# EAGLE schematic CarrerAI_BB_V1.0 (EAGLE 7.7.0)

## Sheet 1 of 2: POW-System Supply Chain
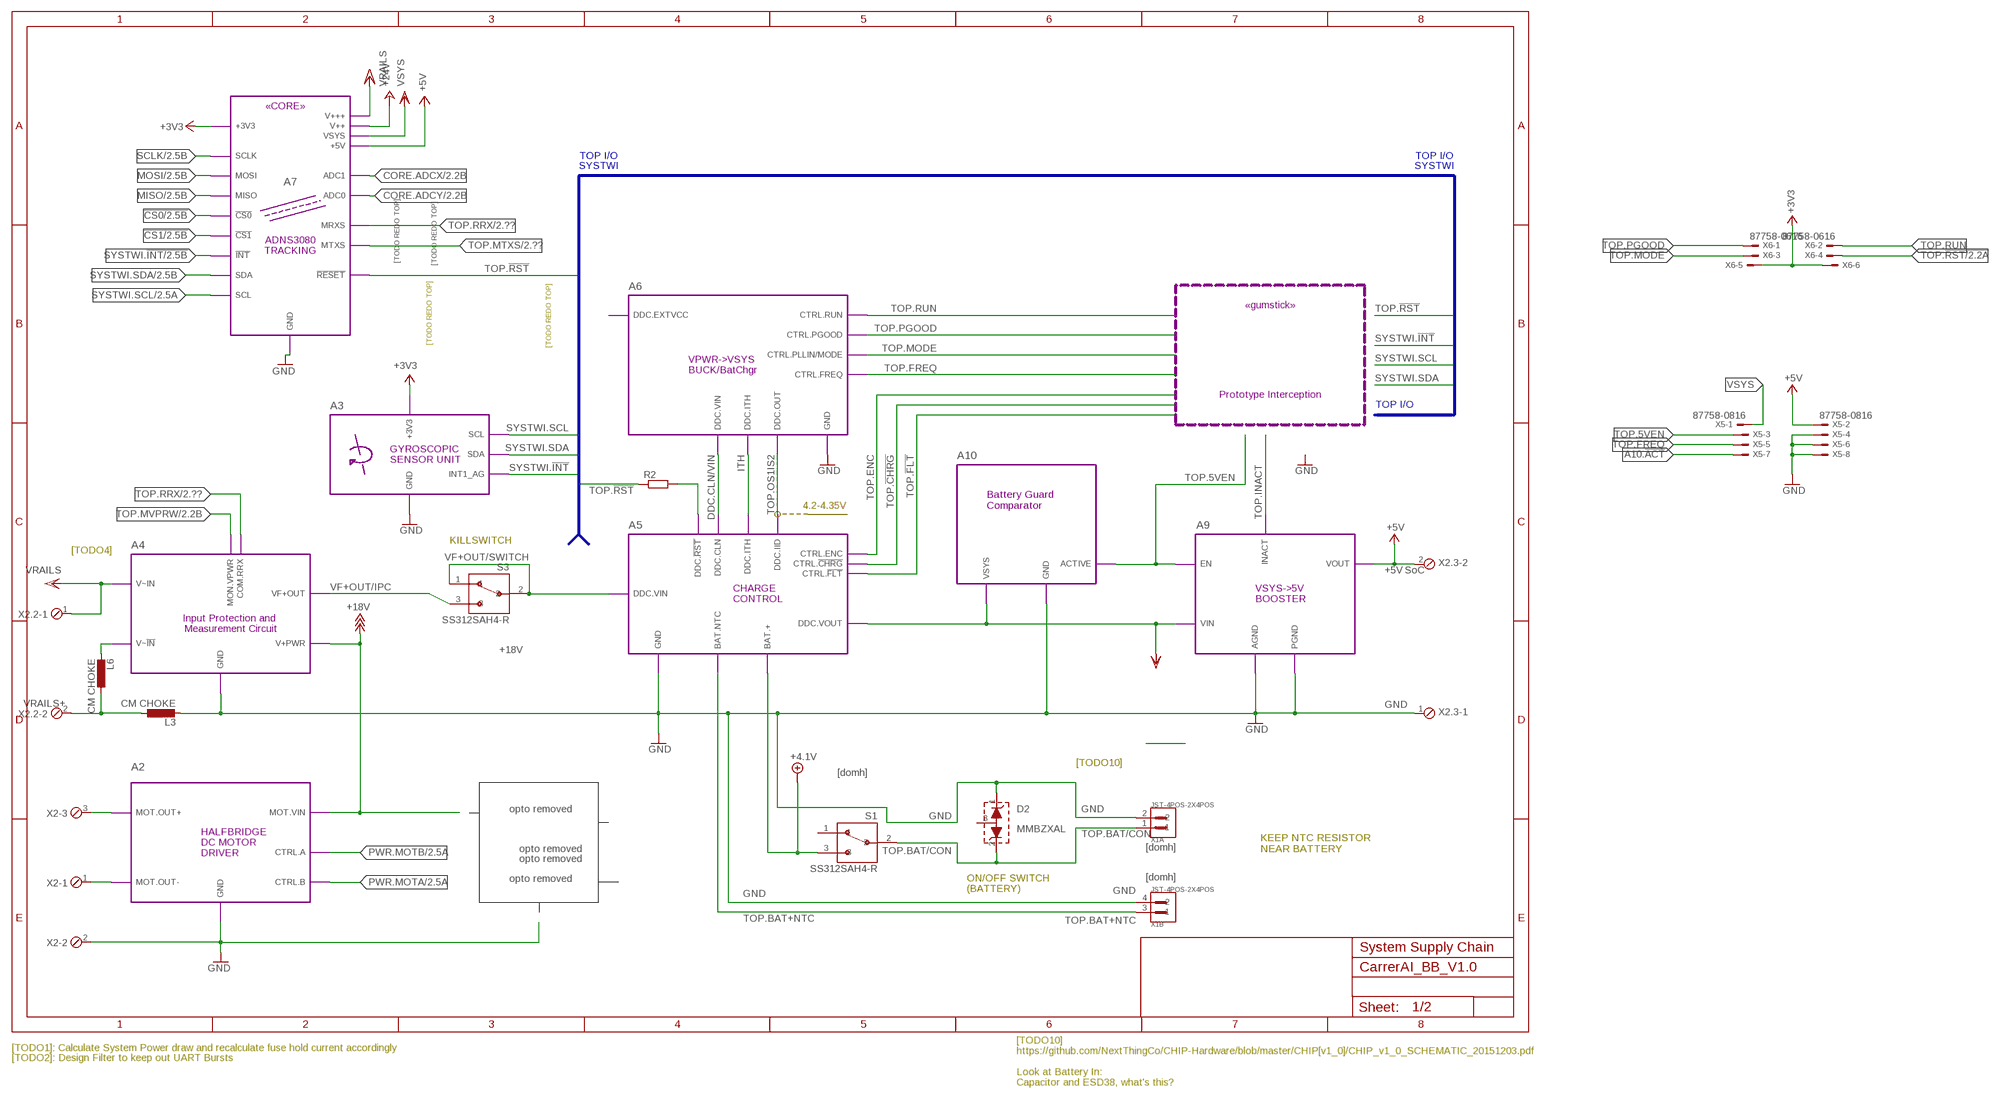
[diagram p0: schematic, sheet 1]

### Parts
D2  MMBZXAL  [TO236]
L3  CM CHOKE  L-EUL3216C  [L3216C]
L6  CM CHOKE  L-EUL3216C  [L3216C]
R2  R-EU_R0201  [R0201]
S1  SS312SAH4-R  [SW_SS312SAH4-R]
S3  SS312SAH4-R  [SW_SS312SAH4-R]
X1  JST-4POS-2X4POS  [JST-PHR-4]
X2  MPT3  [3POL254]
X2.2  VRAILS+  MPT2  [2POL254]
X2.3  SoC  MPT2  [2POL254]
X5  87758-0816  [87758-0816]
X6  87758-0616  [87758-0616]

### Module instances
A5 = POW-4000
A6 = POW-3891
A2 = POW-8871
A9 = POW-DDC3350
A7 = X1-TRACKBOARD3080
A4 = POW-IPMC
A3 = SEN-GYRO1
A10 = POW-1540

### Nets
!CS0: port A7.!CS0 ; also sheet 2
!CS1: port A7.!CS1 ; also sheet 2
!RST: R2.2 ; port A5.DDC.!RST
+3V3: X6.5 X6.6 ; port A7.+3V3 A3.+3V3 ; also sheet 2
+4.1V: S1.3 ; port A5.BAT.+ ; also sheet 2
+5V: X2.3.2 X5.2 ; port A9.VOUT A7.+5V ; also sheet 2
+18V: port A2.MOT.VIN A4.V+PWR ; also sheet 2
+24V: port A7.V++
A10.!ACT: X5.7
CORE.ADCX: port A7.ADC1 ; also sheet 2
CORE.ADCY: port A7.ADC0 ; also sheet 2
DDC.CLN/VIN: port A6.DDC.VIN A5.DDC.CLN
GND: D2.1(A) L3.2 X1.2 X1.4 X2.2 X2.3.1 X5.4 X5.6 X5.8 ; port A6.GND A5.GND A9.AGND A9.PGND A4.GND A10.GND A2.GND A7.GND A3.GND ; also sheet 2
ITH: port A6.DDC.ITH A5.DDC.ITH
MISO: port A7.MISO ; also sheet 2
MOSI: port A7.MOSI ; also sheet 2
N$5: L3.1 L6.1 X2.2.2
N$17: L6.2 ; port A4.V~!IN
PWR.MOTA: port A2.CTRL.B ; also sheet 2
PWR.MOTB: port A2.CTRL.A ; also sheet 2
SCLK: port A7.SCLK ; also sheet 2
SYSTWI.!INT: port A3.INT1_AG A7.!INT ; also sheet 2
SYSTWI.SCL: port A3.SCL A7.SCL ; also sheet 2
SYSTWI.SDA: port A3.SDA A7.SDA ; also sheet 2
TOP.5VEN: X5.3 ; port A9.EN A10.ACTIVE
TOP.!CHRG: port A5.CTRL.!CHRG
TOP.!FLT: port A5.CTRL.!FLT
TOP.!RST: R2.1 X6.4 ; port A7.!RESET ; also sheet 2
TOP.BAT+NTC: X1.3 ; port A5.BAT.NTC
TOP.BAT/CON: D2.2(B) S1.2 X1.1
TOP.ENC: port A5.CTRL.ENC
TOP.FREQ: X5.5 ; port A6.CTRL.FREQ
TOP.INACT: port A9.INACT
TOP.MODE: X6.3 ; port A6.CTRL.PLLIN/MODE
TOP.MOT-: X2.1 ; port A2.MOT.OUT-
TOP.MTXS: port A7.MTXS ; also sheet 2
TOP.MVPRW: port A4.MON.VPWR ; also sheet 2
TOP.OS1IS2: port A6.DDC.OUT A5.DDC.IID
TOP.PGOOD: X6.1 ; port A6.CTRL.PGOOD
TOP.RRX: port A4.COM.RRX A7.MRXS ; also sheet 2
TOP.RUN: X6.2 ; port A6.CTRL.RUN
VCC/2: X2.2.1 ; port A4.V~IN A7.V+++ ; supply symbol labelled VRAILS
VF+OUT/IPC: S3.3 ; port A4.VF+OUT
VF+OUT/SWITCH: S3.1 S3.2 ; port A5.DDC.VIN
VSYS: X5.1 ; port A5.DDC.VOUT A9.VIN A10.VSYS A7.VSYS ; supply symbol labelled NOT VSYS ANYMORE ; also sheet 2
✳TOP.MOT+: X2.3 ; port A2.MOT.OUT+
Unconnected: D2.3(COM) S1.1

### Buses
TOP[0..7],SYSTWI.SCL,SYSTWI.SDA,SYSTWI.!INT,TOP.!RST
TOP[0..7]

### Notes on the sheet
- «CORE»
- TOP I/O | TOP I/O
- SYSTWI | SYSTWI
- ADNS3080
  TRACKING
- [TODO REDO TOP]
- [TODO REDO TOP]
- «gumstick»
- ⨯
- [TODO REDO TOP]
- [TODO REDO TOP]
- ↯ | ⎚
- ↯
- VPWR->VSYS
  BUCK/BatChgr
- Prototype Interception
- TOP I/O
- GYROSCOPIC
  SENSOR UNIT
- 4.2-4.35V
- Battery Guard 
  Comparator
- KILLSWITCH
- [TODO4]
- ⎚
- CHARGE
  CONTROL
- VSYS->5V
  BOOSTER
- ↯
- ↯
- Input Protection and 
  Measurement Circuit
- [TODO10]
- [domh]
- opto removed
- ↯
- HALFBRIDGE
  DC MOTOR
  DRIVER
- [domh]
- opto removed
- KEEP NTC RESISTOR
  NEAR BATTERY
- opto removed
- [domh]
- opto removed
- ON/OFF SWITCH
  (BATTERY)
- System Supply Chain
- [TODO1]: Calculate System Power draw and recalculate fuse hold current accordingly
- [TODO2]: Design Filter to keep out UART Bursts
- [TODO10]
  https://github.com/NextThingCo/CHIP-Hardware/blob/master/CHIP[v1_0]/CHIP_v1_0_SCHEMATIC_20151203.pdf
  
  Look at Battery In:
  Capacitor and ESD38, what's this?

## Sheet 2 of 2: X - Connectors Inputs, Outputs and Power
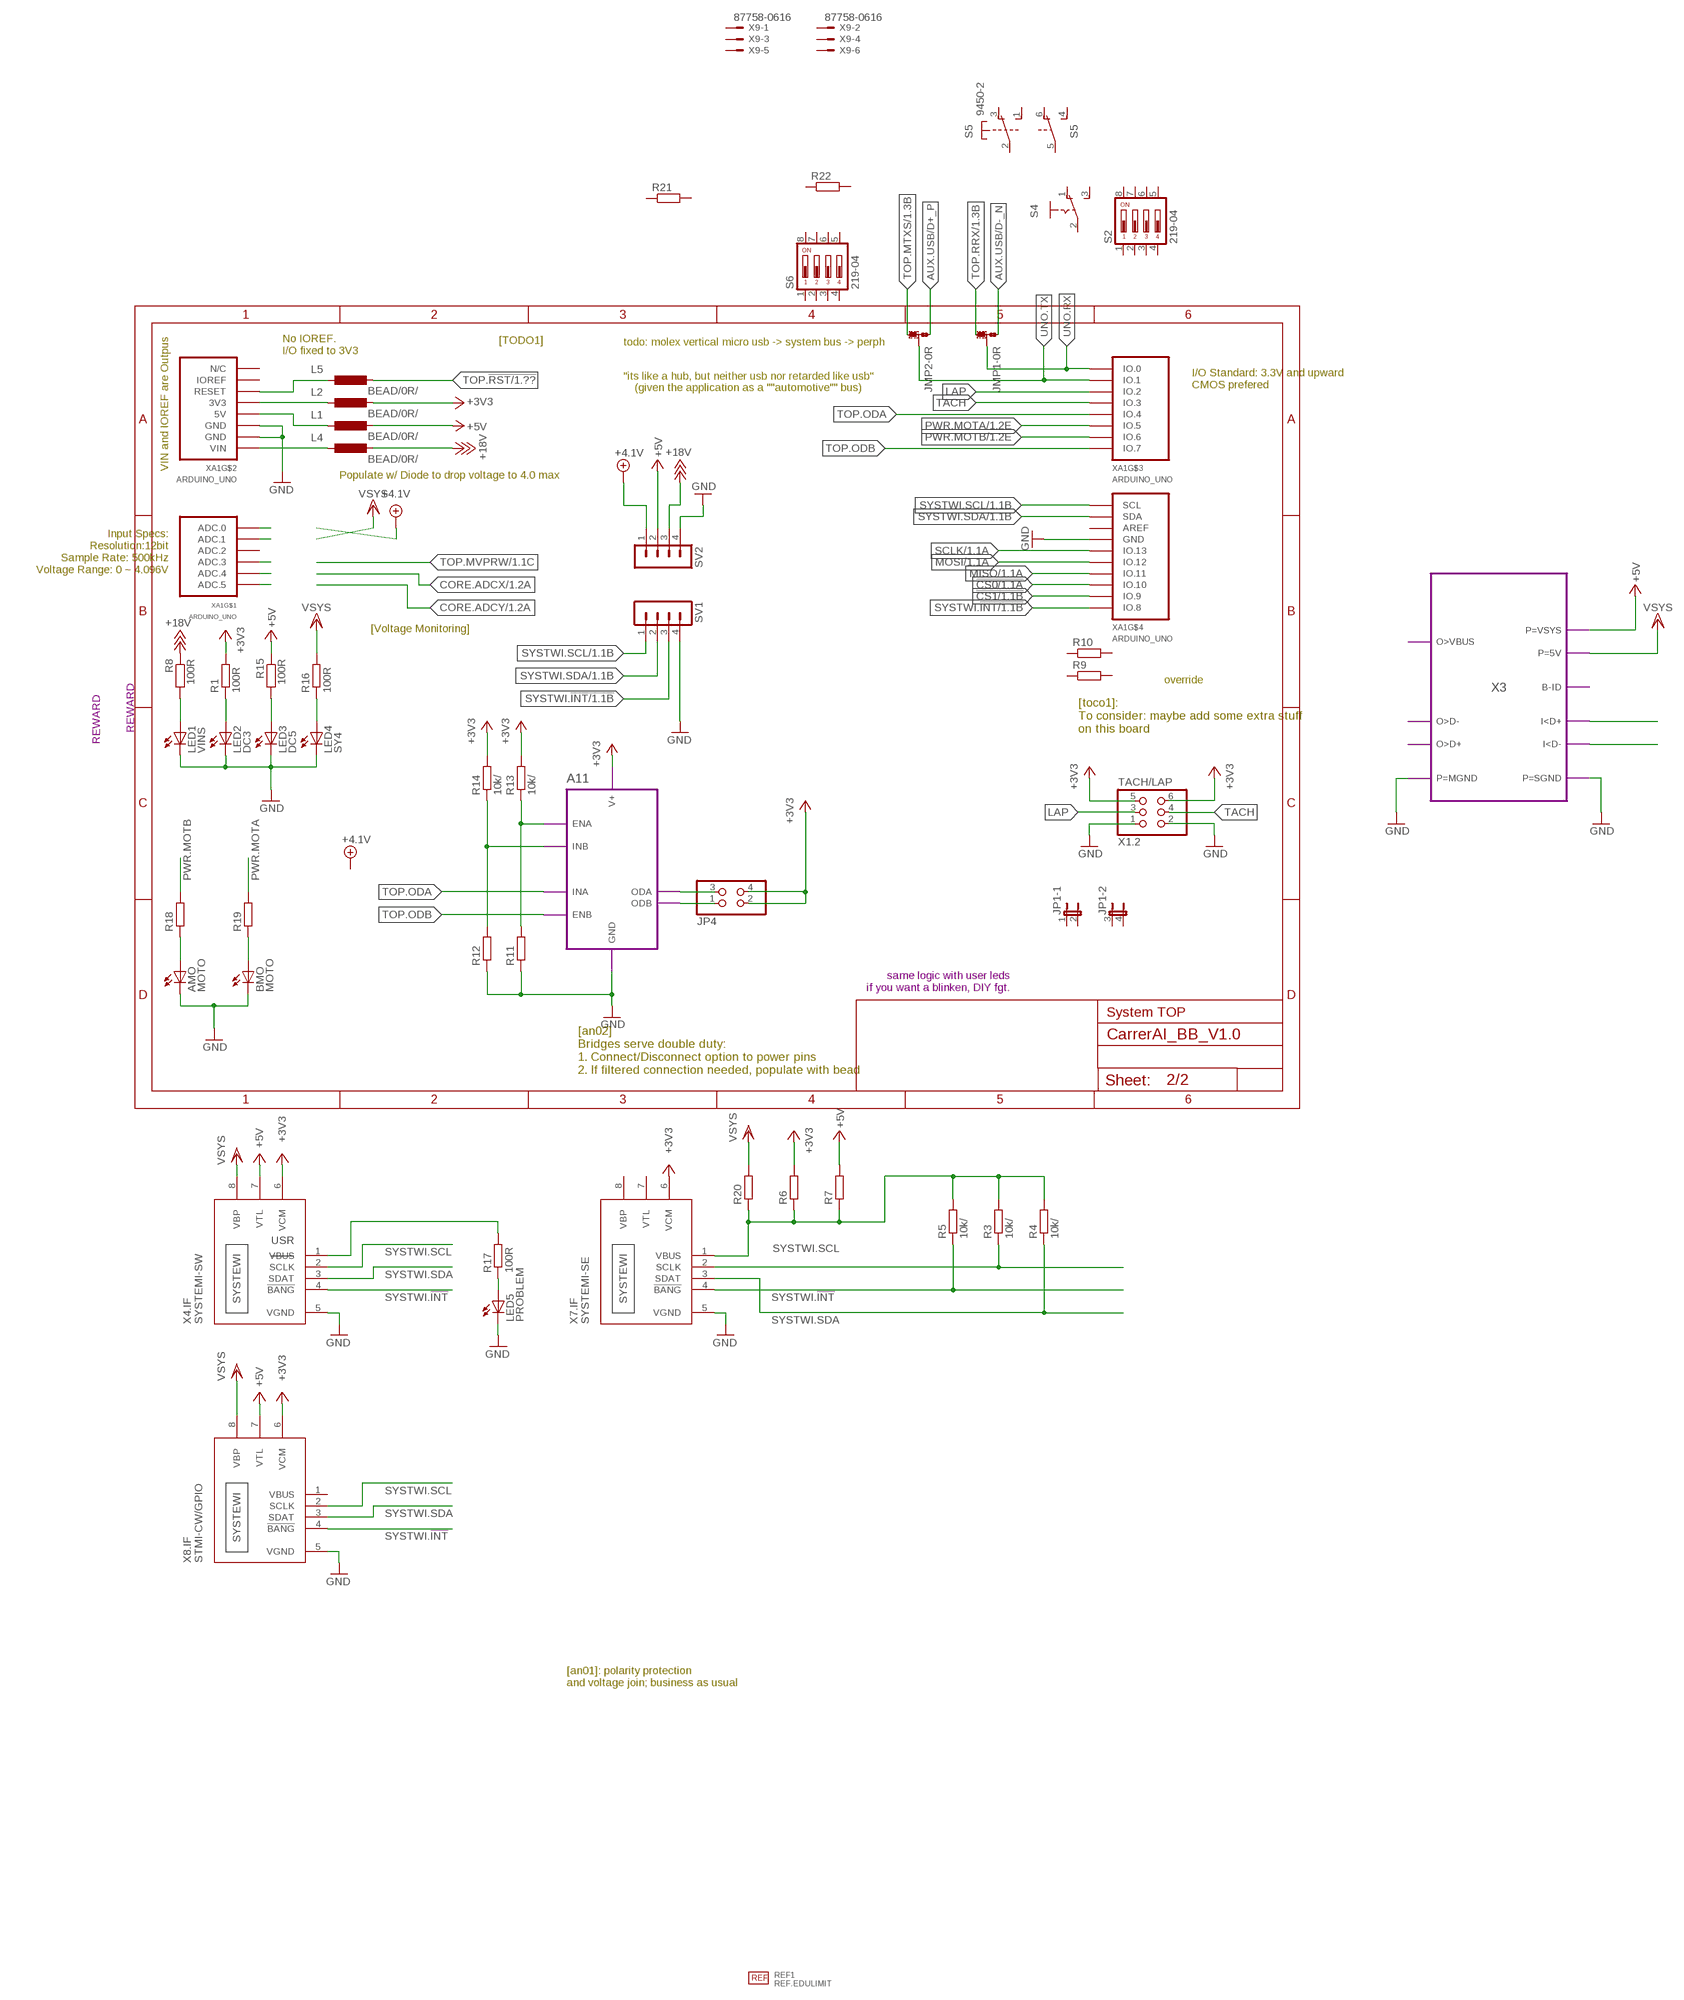
[diagram p1: schematic, sheet 2]

### Parts
AMO  MOTO  LEDCHIP-LED0805  [CHIP-LED0805]
BMO  MOTO  LEDCHIP-LED0805  [CHIP-LED0805]
JMP1  0R-JUMPA  [A0R-JMP]
JMP2  0R-JUMPA  [A0R-JMP]
JP1  JP2QE  [JP2Q]
JP4  PINHD-2X2  [2X02]
L1  BEAD/0R/⎵  L-EUL2012C  [L2012C]
L2  BEAD/0R/⎵  L-EUL2012C  [L2012C]
L4  BEAD/0R/⎵  L-EUL2012C  [L2012C]
L5  BEAD/0R/⎵  L-EUL2012C  [L2012C]
LED1  VINS  LEDCHIP-LED0805  [CHIP-LED0805]
LED2  DC3  LEDCHIP-LED0805  [CHIP-LED0805]
LED3  DC5  LEDCHIP-LED0805  [CHIP-LED0805]
LED4  SY4  LEDCHIP-LED0805  [CHIP-LED0805]
LED5  PROBLEM  LEDCHIP-LED0805  [CHIP-LED0805]
R1  100R  R-EU_0204/2V  [0204V]
R3  10k/⎒  R-EU_R0402  [R0402]
R4  10k/⎒  R-EU_R0402  [R0402]
R5  10k/⎒  R-EU_R0402  [R0402]
R6  R-EU_R0201  [R0201]
R7  R-EU_R0201  [R0201]
R8  100R  R-EU_0204/2V  [0204V]
R9  R-EU_R0201  [R0201]
R10  R-EU_R0201  [R0201]
R11  R-EU_R0201  [R0201]
R12  R-EU_R0201  [R0201]
R13  10k/⎒  R-EU_R0402  [R0402]
R14  10k/⎒  R-EU_R0402  [R0402]
R15  100R  R-EU_0204/2V  [0204V]
R16  100R  R-EU_0204/2V  [0204V]
R17  100R  R-EU_R0201  [R0201]
R18  R-EU_R0201  [R0201]
R19  R-EU_R0201  [R0201]
R20  R-EU_R0201  [R0201]
R21  R-EU_R0201  [R0201]
R22  R-EU_R0201  [R0201]
REF1  REF.EDULIMIT  [REF_EAGLE.EDULIMIT]
S2  219-04  [CTS-219-04]
S4  255SB  [255SB]
S5  9450-2  [9450-2]
S6  219-04  [CTS-219-04]
SV1  MA04-1  [MA04-1]
SV2  MA04-1  [MA04-1]
X1.2  TACH/LAP  PINHD-2X3  [2X03]
X4  SYSTEMI-SW  SYSTEWI-XR1/PSXPS08  [SYSTEWI-BR1.SOIC8C]
X7  SYSTEMI-SE  SYSTEWI-XR1/PSXPS08  [SYSTEWI-BR1.SOIC8C]
X8  STMI-CW/GPIO  SYSTEWI-XR1/PSXPS16/G8  [SYSTEWI-BR1.SOIC16]
X9  87758-0616  [87758-0616]
XA1  ARDUINO_UNO  [AU_PINS]

### Module instances
A11 = POW-DRV02
X3 = XS-USB02

### Nets
!CS0: XA1.IO.10 ; also sheet 1
!CS1: XA1.IO.9 ; also sheet 1
+3V3: JP4.2 JP4.4 L2.1 R1.2 R6.2 R13.2 R14.2 X1.2.5 X1.2.6 X4.6(.IF:VCM) X7.6(.IF:VCM) X8.6(.IF:VCM) ; port A11.V+ ; also sheet 1
+4.1V: SV2.1 ; also sheet 1
+5V: L1.1 R7.2 R15.1 SV2.2 X4.7(.IF:VTL) X8.7(.IF:VTL) ; port X3.P=VSYS ; also sheet 1
+18V: L4.1 R8.1 SV2.3 ; also sheet 1
AUX.USB/D+_P: JMP2.1 ; port X3.I<D+
AUX.USB/D-_N: JMP1.1 ; port X3.I<D-
GND: AMO.C BMO.C LED1.C LED2.C LED3.C LED4.C LED5.C R11.1 R12.1 SV1.4 SV2.4 X1.2.1 X1.2.2 X4.5(.IF:VGND) X7.5(.IF:VGND) X8.5(.IF:VGND) XA1.GND2(GND) XA1.GND3(GND) XA1.GND.1(GND) ; port A11.GND X3.P=MGND X3.P=SGND ; also sheet 1
LAP: X1.2.3 XA1.IO.2
MISO: XA1.IO.11 ; also sheet 1
MOSI: XA1.IO.12 ; also sheet 1
N$2: JP4.1 ; port A11.ODB
N$3: JP4.3 ; port A11.ODA
N$4: LED1.A R8.2
N$6: R11.2 R13.1 ; port A11.ENA
N$7: R12.2 R14.1 ; port A11.INB
N$9: LED2.A R1.1
N$16: LED3.A R15.2
N$18: XA1.ADC.1
N$19: XA1.ADC.0
N$31: LED4.A R16.1
N$32: LED5.A R17.1
N$33: R17.2 X4.1(.IF:VBUS)
N$34: AMO.A R18.1
N$35: BMO.A R19.1
PWR.MOTA: R19.2 XA1.IO.5 ; also sheet 1
PWR.MOTB: R18.2 XA1.IO.6 ; also sheet 1
SCLK: XA1.IO.13 ; also sheet 1
SYSTWI.!INT: R5.1 SV1.3 X4.4(.IF:!BANG) X7.4(.IF:!BANG) X8.4(.IF:!BANG) XA1.IO.8 ; also sheet 1
SYSTWI.SCL: R3.1 SV1.1 X4.2(.IF:SCLK) X7.2(.IF:SCLK) X8.2(.IF:SCLK) XA1.SCL ; also sheet 1
SYSTWI.SDA: R4.1 SV1.2 X4.3(.IF:SDAT) X7.3(.IF:SDAT) X8.3(.IF:SDAT) XA1.SDA ; also sheet 1
SYSTWI.VBUS: R3.2 R4.2 R5.2 R6.1 R7.1 R20.1 X7.1(.IF:VBUS)
TACH: X1.2.4 XA1.IO.3
TOP.!RST: L5.1 ; also sheet 1
TOP.MTXS: JMP2.3 ; also sheet 1
TOP.ODA: XA1.IO.4 ; port A11.INA
TOP.ODB: XA1.IO.7 ; port A11.ENB
TOP.RRX: JMP1.3 ; also sheet 1
UNO.3V3: L2.2 XA1.3.3V(3V3)
UNO.5V: L1.2 XA1.5V
UNO.ADC3: XA1.ADC.3
UNO.ADC4: XA1.ADC.4
UNO.ADC5: XA1.ADC.5
UNO.RESET: L5.2 XA1.RESET
UNO.RX: JMP1.2 XA1.IO.0
UNO.TX: JMP2.2 XA1.IO.1
UNO.VIN: L4.2 XA1.VIN
VSYS: R16.2 R20.2 X4.8(.IF:VBP) X8.8(.IF:VBP) ; port X3.P=5V ; also sheet 1
Unconnected: JP1.1 JP1.2 JP1.3 JP1.4 R9.1 R9.2 R10.1 R10.2 R21.1 R21.2 R22.1 R22.2 S2.1 S2.2 S2.3 S2.4 S2.5 S2.6 S2.7 S2.8 S4.1(O) S4.2(P) S4.3(S) S5.1(1:S) S5.2(1:P) S5.3(1:O) S5.4(2:S) S5.5(2:P) S5.6(2:O) S6.1 S6.2 S6.3 S6.4 S6.5 S6.6 S6.7 S6.8 X9.1 X9.2 X9.3 X9.4 X9.5 X9.6 XA1.ADC.2 XA1.AREF XA1.I/OREF(IOREF) XA1.N/C

### Notes on the sheet
- No IOREF.
  I/O fixed to 3V3
- [TODO1]
- todo: molex vertical micro usb -> system bus -> perph
- ⨯
- I/O Standard: 3.3V and upward
  CMOS prefered
- ⨯ | "its like a hub, but neither usb nor retarded like usb"
- (given the application as a ""automotive"" bus)
- VIN and IOREF are Outpus | Populate w/ Diode to drop voltage to 4.0 max
- ⨯
- Input Specs:
  Resolution:12bit
  Sample Rate: 500kHz
  Voltage Range: 0 ~ 4.096V
- [Voltage Monitoring]
- override
- REWARD
- [toco1]:
  To consider: maybe add some extra stuff
  on this board
- REWARD
- same logic with user leds
  if you want a blinken, DIY fgt.
- System TOP
- [an02]
  Bridges serve double duty:
  1. Connect/Disconnect option to power pins
  2. If filtered connection needed, populate with bead
- ⨯ | ⨯
- USR
- [an01]: polarity protection
  and voltage join; business as usual

## Power pins joined to a net without a drawn wire
VBP: X7.8(.IF:VBP)
VBUS: X8.1(.IF:VBUS)
VTL: X7.7(.IF:VTL)

## Library data of the parts
AMO BMO LED1-LED5 = led:LED: LED OSRAM: - CHIPLED LG R971, LG N971, LY N971, LG Q971, LY Q971, LO R971, LY R971 LH N974, LH R974 LS Q976, LO Q976, LY Q976 LO Q996 - Hyper CHIPLED LW Q18S LB Q993, LB Q99A, LB R99A - SideLED LS A670, LO A670, LY A670, LG A670, LP A670 LB A673, LV A673, LT A673, LW A673 LH A674 LY A675 LS A676, LA A676, LO A676, LY A676, LW A676 LS A679, LY A679, LG A679 - Hyper Micro SIDELED® LS Y876, LA Y876, LO Y876, LY Y876 LT Y87S - SmartLED LW L88C, LW L88S LB L89C, LB L89S, LG L890 LS L89K, LO L89K, LY L89K LS L896, LA L896, LO L896, LY L896 - TOPLED LS T670, LO T670, LY T670, LG T670, LP T670 LSG T670, LSP T670, LSY T670, LOP T670, LYG T670 LG T671, LOG T671, LSG T671 LB T673, LV T673, LT T673, LW T673 LH T674 LS T676, LA T676, LO T676, LY T676, LB T676, LH T676, LSB T676, LW T676 LB T67C, LV T67C, LT T67C, LS T67K, LO T67K, LY T67K, LW E67C LS E67B, LA E67B, LO E67B, LY E67B, LB E67C, LV E67C, LT E67C LW T67C LS T679, LY T679, LG T679 LS T770, LO T770, LY T770, LG T770, LP T770 LB T773, LV T773, LT T773, LW T773 LH T774 LS E675, LA E675, LY E675, LS T675 LS T776, LA T776, LO T776, LY T776, LB T776 LHGB T686 LT T68C, LB T68C - Hyper Mini TOPLED® LB M676 - Mini TOPLED Santana® LG M470 LS M47K, LO M47K, LY M47K Source: http://www.osram.convergy.de LUXEON: - LUMILED® LXK2-PW12-R00, LXK2-PW12-S00, LXK2-PW14-U00, LXK2-PW14-V00 LXK2-PM12-R00, LXK2-PM12-S00, LXK2-PM14-U00 LXK2-PE12-Q00, LXK2-PE12-R00, LXK2-PE12-S00, LXK2-PE14-T00, LXK2-PE14-U00 LXK2-PB12-K00, LXK2-PB12-L00, LXK2-PB12-M00, LXK2-PB14-N00, LXK2-PB14-P00, LXK2-PB14-Q00 LXK2-PR12-L00, LXK2-PR12-M00, LXK2-PR14-Q00, LXK2-PR14-R00 LXK2-PD12-Q00, LXK2-PD12-R00, LXK2-PD12-S00 LXK2-PH12-R00, LXK2-PH12-S00 LXK2-PL12-P00, LXK2-PL12-Q00, LXK2-PL12-R00 Source: www.luxeon.com KINGBRIGHT: KA-3528ASYC Source: www.kingbright.com
D2 = kitt.ic:MMBZXAL; CC: XYX17
JMP1 JMP2 = jump-0r-smd:0R-JUMP: SMD 0R 0805 Jumper
JP1 = jumper:JP2QE: JUMPER
JP4 = pinhead:PINHD-2X2: PIN HEADER
L1-L6 = rcl:L-EU: INDUCTOR, European symbol
R1-R22 = rcl:R-EU_: RESISTOR, European symbol
REF1 = kitt.refs:REF.EDULIMIT
S1 S3 = kitt.psvs:SS312SAH4-R: Switch Slide ON None ON SPDT Side Slide 0.1A 28VAC 28VDC 0.4VA 10000Cycles Gull Wing SMD T/R; AVAILABILITY: Good; DESCRIPTION: Switch Slide ON None ON SPDT Side Slide 0.1A 28VAC 28VDC 0.4VA 10000Cycles Gull Wing SMD T/R; MF: NKK Switches; MP: SS312SAH4-R; PACKAGE: None; PRICE: 2.48 USD
S2 S6 = switch-dil:219-04*: Surface Mount DIP Switch Series 219 SMT CTS Electronic Components Sourc: www.ctscorp.com; OC_FARNELL: unknown; OC_NEWARK: unknown
S4 = switch:255SB: SLIDING SWITCH Distributor Buerklin, 11G810
S5 = switch-misc:9450-2: MARQUARDT SWITCH
SV1 SV2 = con-lstb:MA04-1: PIN HEADER; OC_FARNELL: unknown; OC_NEWARK: unknown
X1 = kitt.con:JST-4POS-2X; CC: XYX17
X1.2 = pinhead:PINHD-2X3: PIN HEADER
X2 = con-phoenix-254:MPT3: PHOENIX CONNECTOR; OC_FARNELL: unknown; OC_NEWARK: unknown
X2.2 X2.3 = con-phoenix-254:MPT2: PHOENIX CONNECTOR; OC_FARNELL: unknown; OC_NEWARK: unknown
X4 X7 X8 = con-hht.systewi:SYSTEWI-XR1/PSX: Poststamp Form Factor Module Patterns for Rapid Prototyping and serviceable high-reliance electronic systems
X5 = con-molex:87758-0816: 8 Pin - 2mm Dual Row Single Wafer, Vertical T/H HDR Source: http://www.molex.com/pdm_docs/sd/877580616_sd.pdf; MF: MOLEX; MPN: 87758-0816; OC_FARNELL: 7472331; OC_NEWARK: 59J1556
X6 X9 = con-molex:87758-0616: 6 Pin - 2mm Dual Row Single Wafer, Vertical T/H HDR Source: http://www.molex.com/pdm_docs/sd/877580616_sd.pdf; MPN: 87758-0616; OC_FARNELL: 7472323; OC_NEWARK: 25M5667
XA1 = kitt.con:ARDUINO_UNO

## Module POW-4000
Ports: DDC.!RST(out) BAT.+(pwr) BAT.NTC(io) GND(pwr) DDC.CLN(io) DDC.ITH(io) DDC.VIN(pwr) DDC.VOUT(pwr) DDC.IID(io) CTRL.ENC(in) CTRL.!CHRG(out) CTRL.!FLT(out)
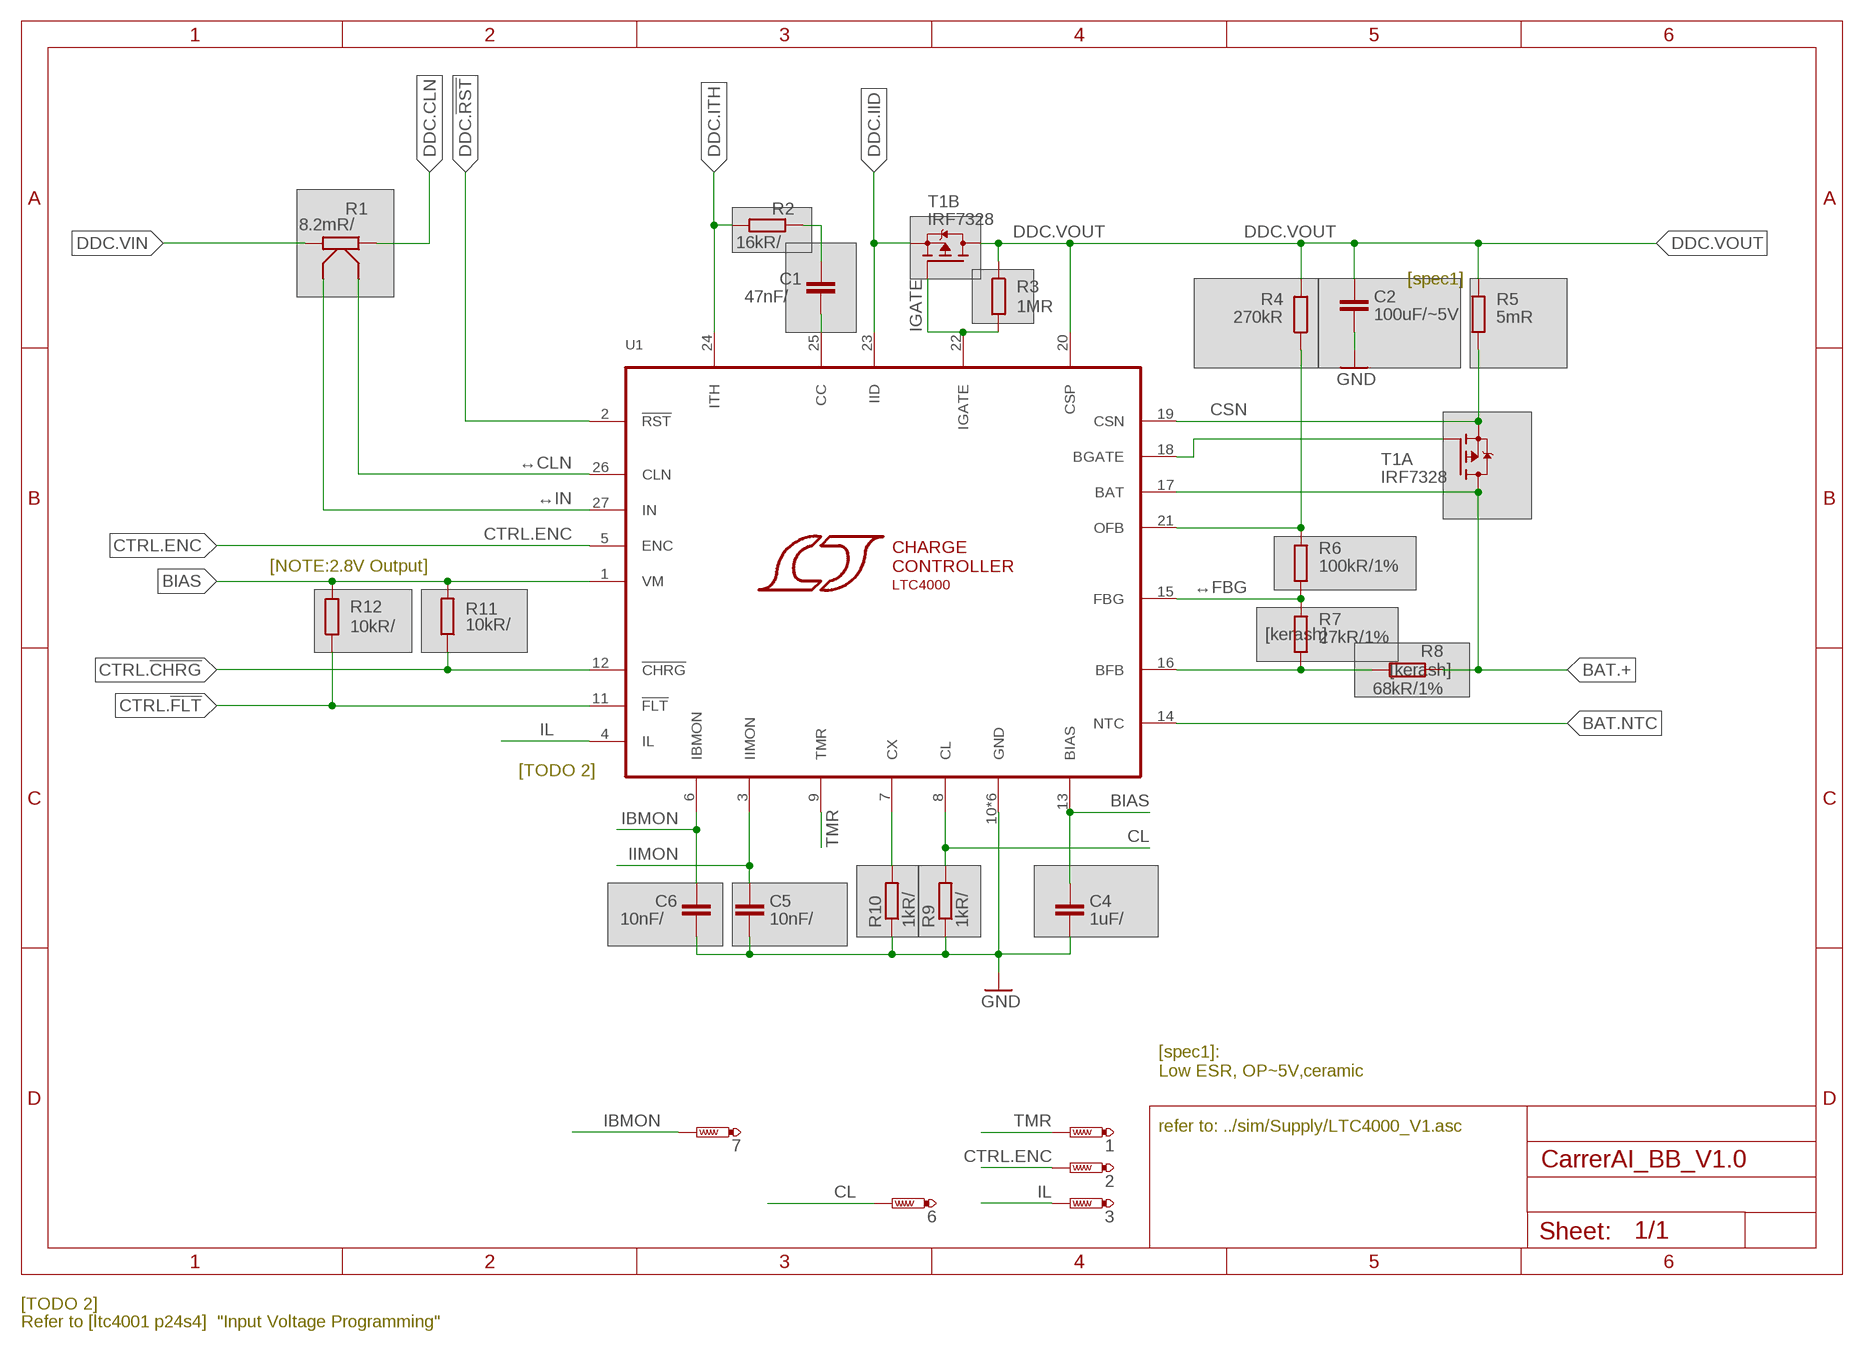
[diagram p2: schematic, module POW-4000, sheet 1]

### Parts
C1  47nF/⇤  C-EUC0603K  [C0603K]
C2  100uF/~5V  C-EUC1206K  [C1206K]
C4  1uF/⇤  C-EUC0402K  [C0402K]
C5  10nF/⇤  C-EUC0402K  [C0402K]
C6  10nF/⇤  C-EUC0402K  [C0402K]
R1  8.2mR/⚻  RKELV1206  [R1206-KELV]
R2  16kR/⇤  R-EU_R0402  [R0402]
R3  1MR  R-EU_R0805  [R0805]
R4  270kR  R-EU_R0402  [R0402]
R5  5mR  R-EU_R0805  [R0805]
R6  100kR/1%  R-EU_R0402  [R0402]
R7  27kR/1%  R-EU_R0402  [R0402]
R8  68kR/1%  R-EU_R0402  [R0402]
R9  1kR/⇤  R-EU_R0402  [R0402]
R10  1kR/⇤  R-EU_R0402  [R0402]
R11  10kR/⎒  R-EU_R0402  [R0402]
R12  10kR/⎒  R-EU_R0402  [R0402]
T1  IRF7328  [SOIC8]
U1  LTC4000LTC4000EUFD-ARMIN  [QFN-28_UFD-L_LONG]
☇1  PTR1TP07R  [TP07R]
☇2  PTR1TP07R  [TP07R]
☇3  PTR1TP07R  [TP07R]
☇6  PTR1TP07R  [TP07R]
☇7  PTR1TP07R  [TP07R]

### Nets
BAT.+: R8.2 T1.7(A:D) T1.8(A:D) U1.17(BAT)
BAT.NTC: U1.14(NTC)
BGATE: T1.2(A:G) U1.18(BGATE)
BIAS: C4.1 R11.2 R12.2 U1.1(VM) U1.13(BIAS)
CC: C1.2 U1.25(CC)
CL: R9.2 U1.8(CL) ☇6.TP
CSN: R5.1 T1.1(A:S) U1.19(CSN)
CTRL.!CHRG: R11.1 U1.12(!CHRG)
CTRL.!FLT: R12.1 U1.11(!FLT)
CTRL.ENC: U1.5(ENC) ☇2.TP
CX: R10.2 U1.7(CX)
DDC.!RST: U1.2(!RST)
DDC.CLN: R1.+
DDC.IID: T1.3(B:S) U1.23(IID)
DDC.ITH: R2.2 U1.24(ITH)
DDC.VIN: R1.-
DDC.VOUT: C2.1 R3.1 R4.2 R5.2 T1.5(B:D) T1.6(B:D) U1.20(CSP)
GND: C2.2 C4.2 C5.2 C6.2 R9.1 R10.1 U1.10(GND) U1.28(GND) U1.EP-NE(GND) U1.EP-NW(GND) U1.EP-SE(GND) U1.EP-SW(GND)
IBMON: C6.1 U1.6(IBMON) ☇7.TP
IGATE: R3.2 T1.4(B:G) U1.22(IGATE)
IIMON: C5.1 U1.3(IIMON)
IL: U1.4(IL) ☇3.TP
N$4: C1.1 R2.1
N$8: R7.1 R8.1 U1.16(BFB)
OFB: R4.1 R6.2 U1.21(OFB)
TMR: U1.9(TMR) ☇1.TP
↔CLN: R1.K+ U1.26(CLN)
↔FBG: R6.1 R7.2 U1.15(FBG)
↔IN: R1.K- U1.27(IN)

### Notes on the sheet
- [spec1]
- [NOTE:2.8V Output]
- [kerash]
- [kerash]
- [TODO 2]
- [spec1]: 
  Low ESR, OP~5V,ceramic
- refer to: ../sim/Supply/LTC4000_V1.asc
- [TODO 2]
- Refer to [ltc4001 p24s4]  "Input Voltage Programming"

### Library data of the parts
C1 C2 C4-C6 = rcl:C-EU: CAPACITOR, European symbol
R1 = kitt.psvs:RKELV
R2-R12 = rcl:R-EU_: RESISTOR, European symbol
T1 = kitt.ic:IRF7328; CC: XYX17
U1 = kitt.ic:LTC4000
☇1-☇3 ☇6 ☇7 = testpad:PTR1: TEST PIN

## Module POW-3891
Ports: DDC.VIN(io) DDC.ITH(io) DDC.OUT(io) CTRL.RUN(in) CTRL.PGOOD(out) CTRL.PLLIN/MODE(in) CTRL.FREQ(in) GND(pwr) DDC.EXTVCC(pwr)
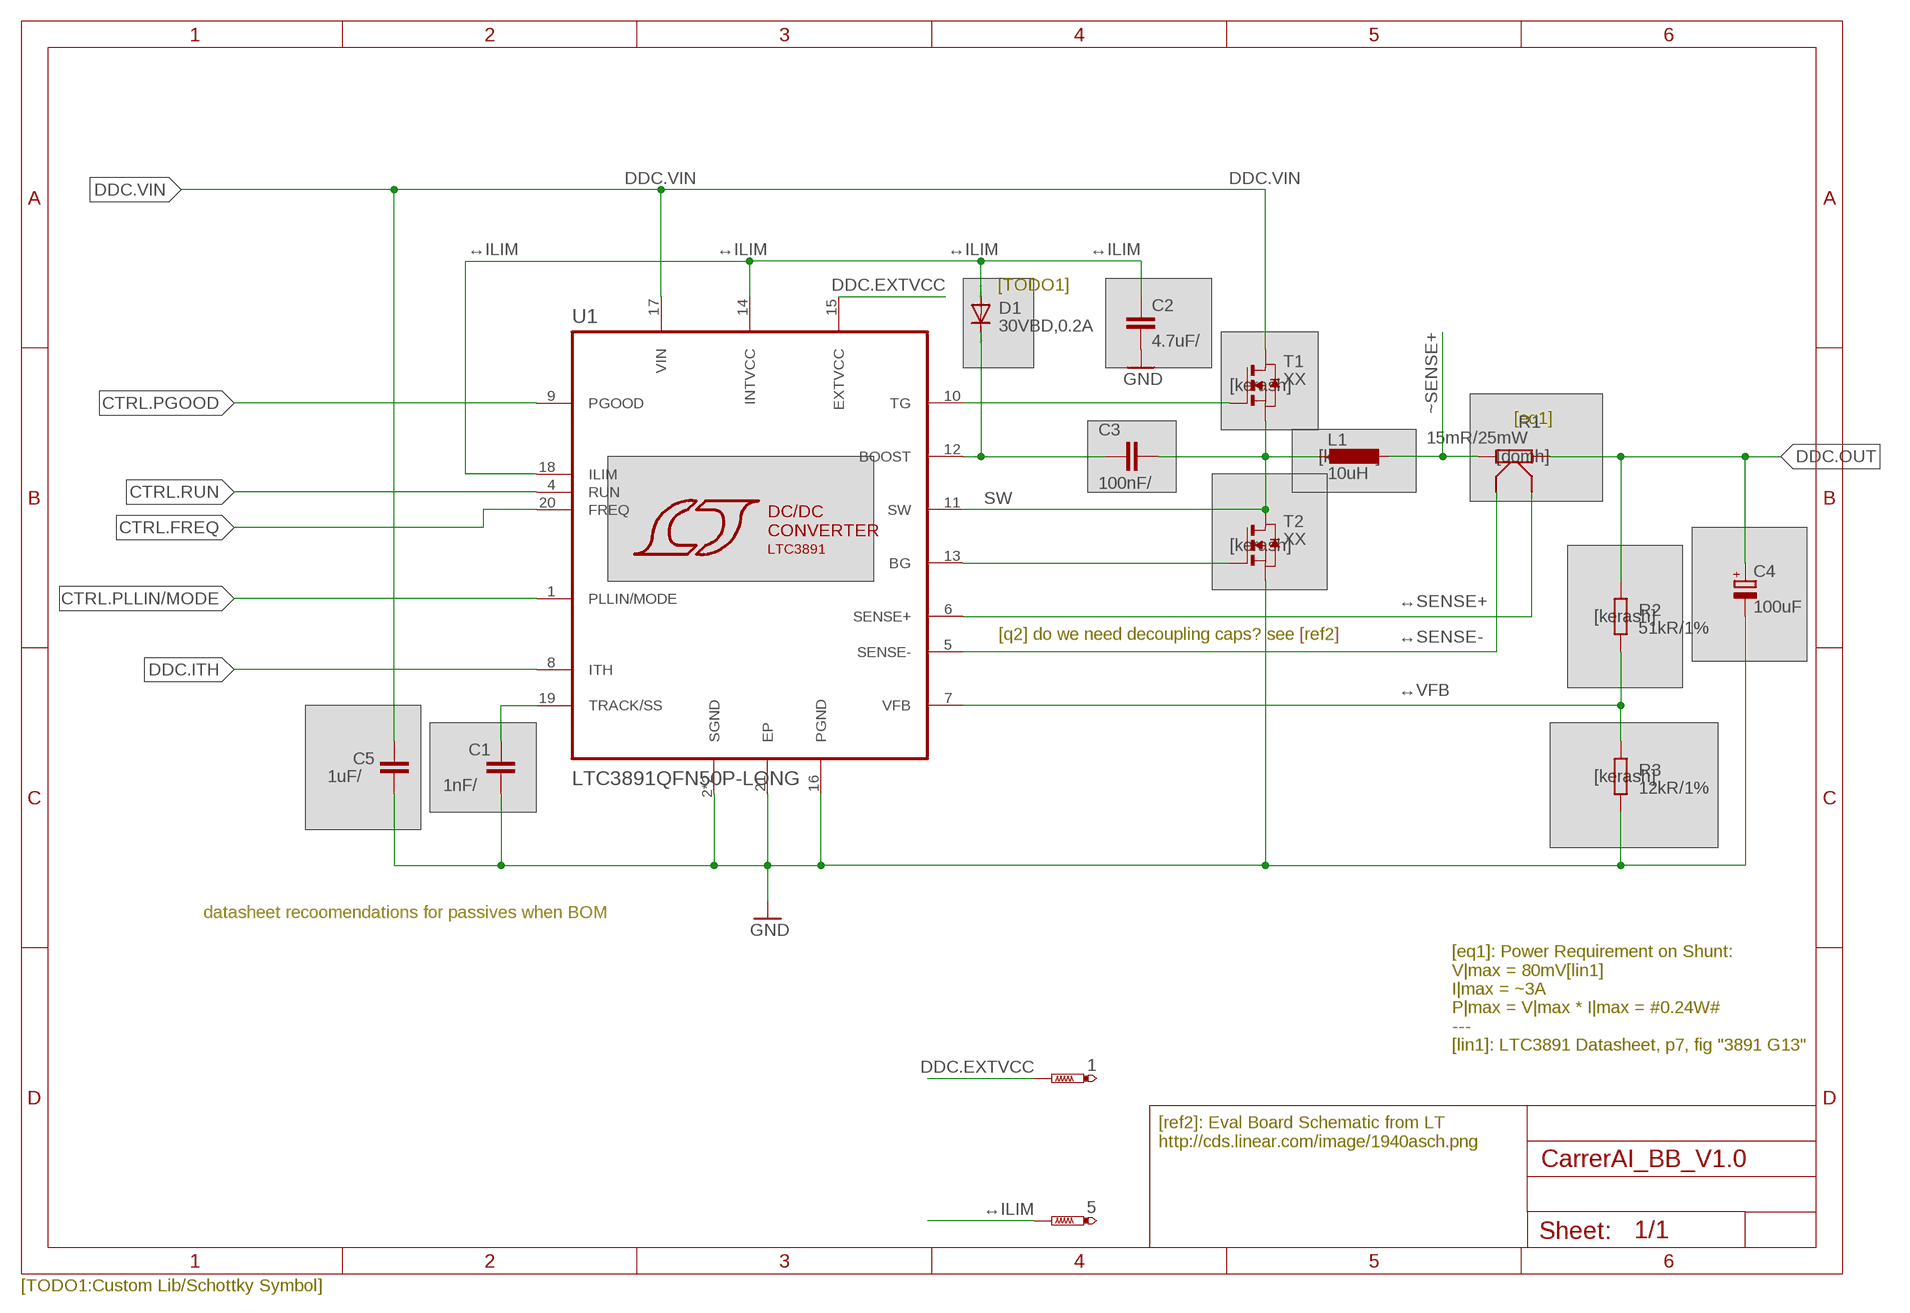
[diagram p3: schematic, module POW-3891, sheet 1]

### Parts
C1  1nF/⇤  C-EUC0402  [C0402]
C2  4.7uF/⇤  C-EUC0805  [C0805]
C3  100nF/⇤  C-EUC0402  [C0402]
C4  100uF  CPOL-EUC/6032-28R  [C/6032-28R]
C5  1uF/⇤  C-EUC0402K  [C0402K]
D1  30VBD,0.2A  DIODE-SOD323-W  [SOD323-W]
L1  10uH  NRS8030XX  [TAIYO-YUDEN.NRS8030T4R7MJGJ]
R1  15mR/25mW⚻  RKELV1206  [R1206-KELV]
R2  51kR/1%  R-EU_R0603  [R0603]
R3  12kR/1%  R-EU_R0603  [R0603]
T1  XX  NMOSMSOP8  [MSOP8]
T2  XX  NMOSMSOP8  [MSOP8]
U1  LTC3891QFN50P-LONG  [QFN50P-LONG]
☇1  PTR1TP07R  [TP07R]
☇5  PTR1TP07R  [TP07R]

### Nets
BG: T2.4(G) U1.13(BG)
CTRL.FREQ: U1.20(FREQ)
CTRL.PGOOD: U1.9(PGOOD)
CTRL.PLLIN/MODE: U1.1(PLLIN/MODE)
CTRL.RUN: U1.4(RUN)
DDC.EXTVCC: U1.15(EXTVCC) ☇1.TP
DDC.ITH: U1.8(ITH)
DDC.OUT: C4.+ R1.+ R2.1
DDC.VIN: C5.1 T1.5(D) T1.6(D) T1.7(D) T1.8(D) U1.17(VIN)
GND: C1.2 C2.2 C4.- C5.2 R3.2 T2.1(S) T2.2(S) T2.3(S) U1.2(SGND) U1.3(SGND) U1.16(PGND) U1.21(EP)
SW✳: C3.2 L1.2 T1.1(S) T1.2(S) T1.3(S) T2.5(D) T2.6(D) T2.7(D) T2.8(D) U1.11(SW)
TG: T1.4(G) U1.10(TG)
TRACK/SS: C1.1 U1.19(TRACK/SS)
~SENSE+: L1.1 R1.-
↔BOOST: C3.1 D1.C U1.12(BOOST)
↔ILIM: C2.1 D1.A U1.14(INTVCC) U1.18(ILIM) ☇5.TP
↔SENSE+: R1.K+ U1.6(SENSE+)
↔SENSE-: R1.K- U1.5(SENSE-)
↔VFB: R2.2 R3.1 U1.7(VFB)

### Notes on the sheet
- [TODO1]
- [kerash]
- [eq1]
- [kerash] | [domh]
- [kerash]
- [kerash]
- [q2] do we need decoupling caps? see [ref2]
- [kerash]
- datasheet recoomendations for passives when BOM
- [eq1]: Power Requirement on Shunt:
  V|max = 80mV[lin1]
  I|max = ~3A
  P|max = V|max * I|max = #0.24W#
  ---
  [lin1]: LTC3891 Datasheet, p7, fig "3891 G13"
- [ref2]: Eval Board Schematic from LT
  http://cds.linear.com/image/1940asch.png
- [TODO1:Custom Lib/Schottky Symbol]

### Library data of the parts
C1-C3 C5 = rcl:C-EU: CAPACITOR, European symbol
C4 = rcl:CPOL-EU: POLARIZED CAPACITOR, European symbol
D1 = diode:DIODE-: DIODE
L1 = kitt.psvs:NRS8030XX
R1 = kitt.psvs:RKELV
R2 R3 = rcl:R-EU_: RESISTOR, European symbol
T1 T2 = zetex:NMOSMSOP8: MOS FET; OC_FARNELL: unknown; OC_NEWARK: unknown
U1 = kitt.ic:LTC3891: Step-Down Controller
☇1 ☇5 = testpad:PTR1: TEST PIN

## Module POW-8871
Ports: GND(pwr) CTRL.A(in) CTRL.B(in) MOT.OUT+(pwr) MOT.OUT-(pwr) MOT.VIN(pwr)
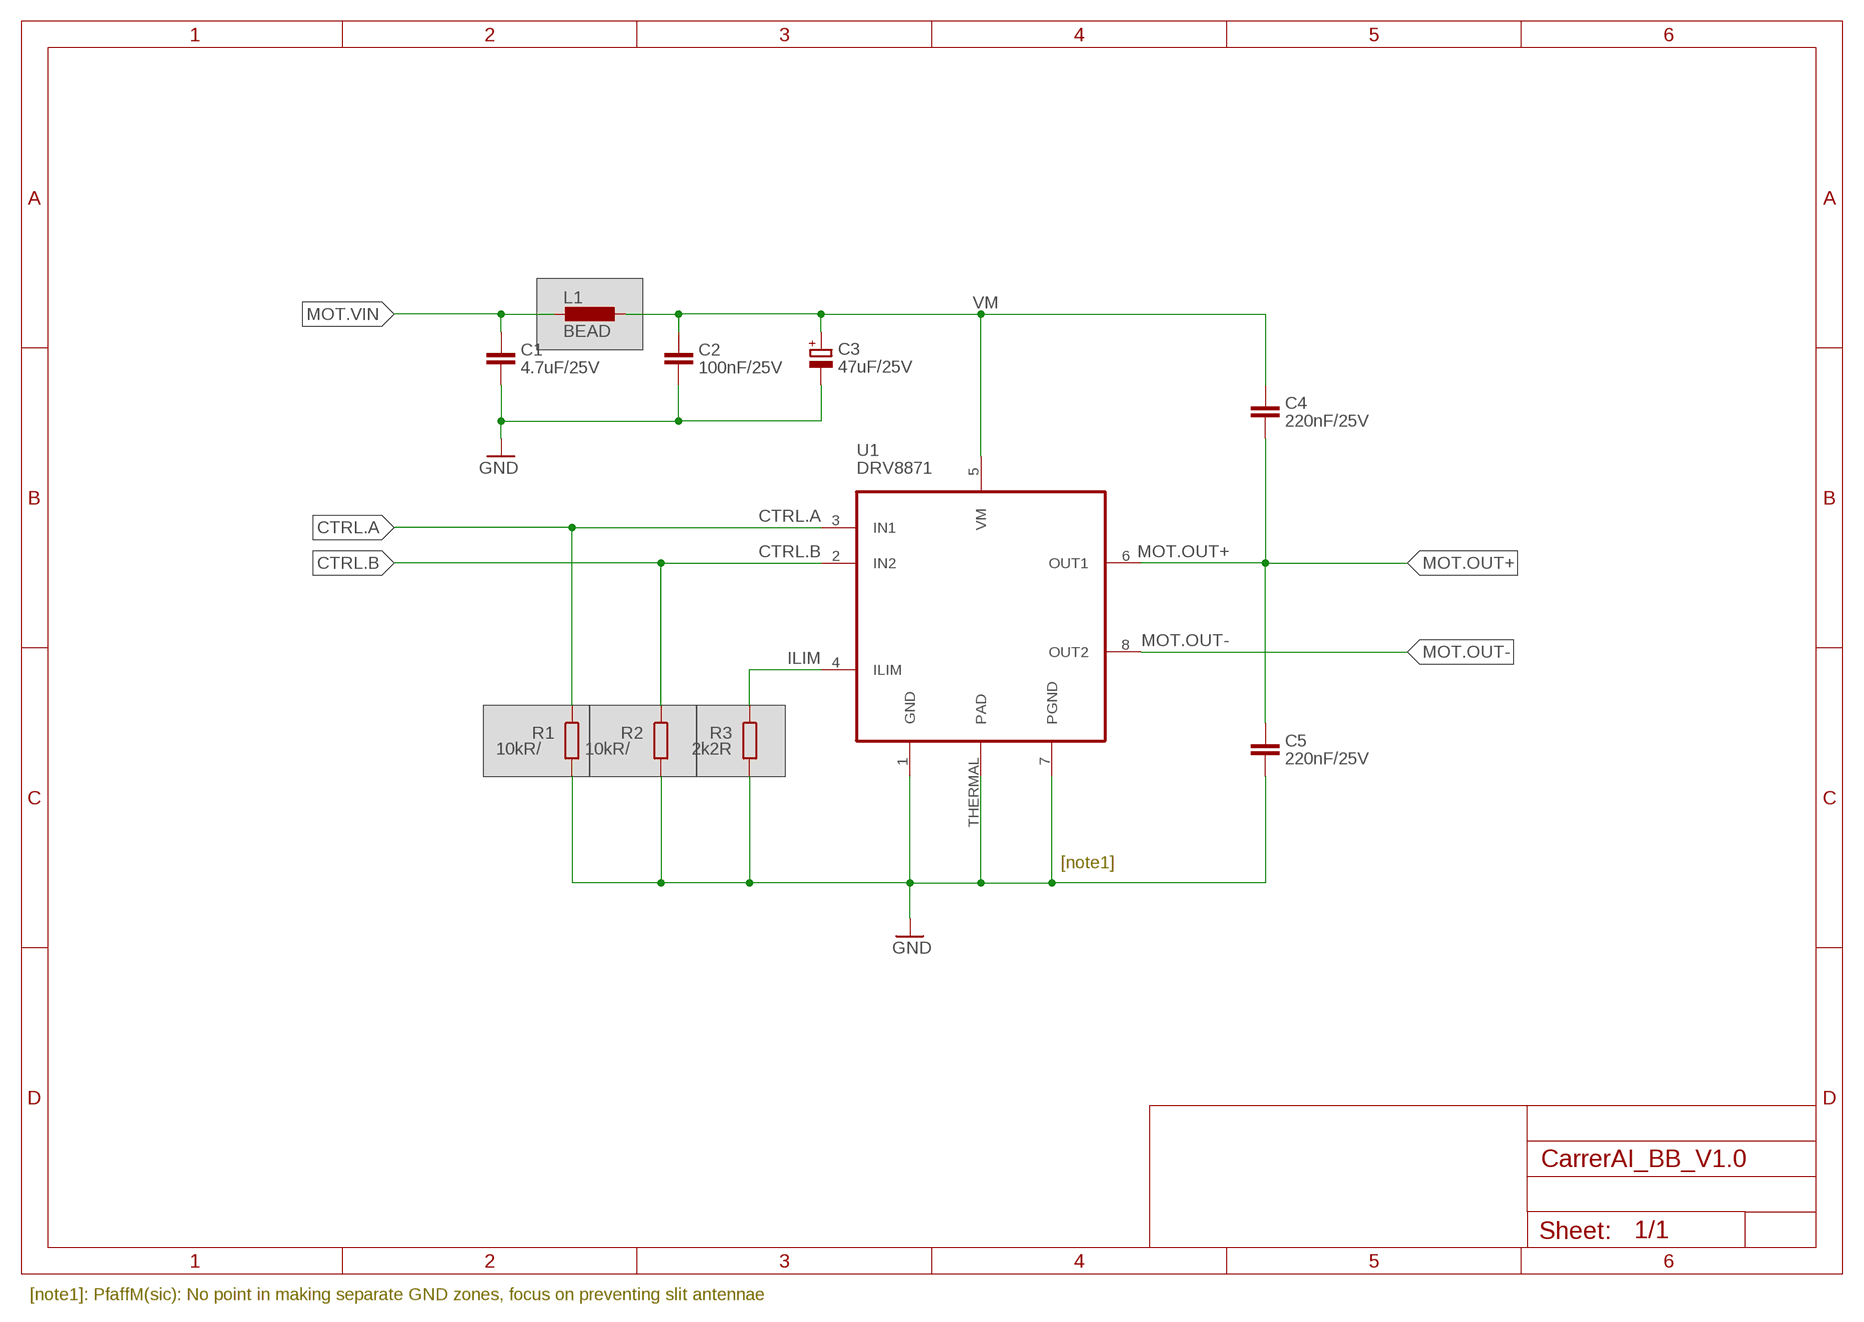
[diagram p4: schematic, module POW-8871, sheet 1]

### Parts
C1  4.7uF/25V  C-EUC0805K  [C0805K]
C2  100nF/25V⇤  C-EUC0603K  [C0603K]
C3  47uF/25V⇤  CPOL-EUCT6032  [CT6032]
C4  220nF/25V⇤  C-EUC0603  [C0603]
C5  220nF/25V⇤  C-EUC0603  [C0603]
L1  BEAD  L-EUL2012C  [L2012C]
R1  10kR/⎑  R-EU_R0402  [R0402]
R2  10kR/⎑  R-EU_R0402  [R0402]
R3  2k2R  R-EU_R0402  [R0402]
U1  DRV8871  DRV8871DRV8871  [HSOP8]

### Nets
CTRL.A: R1.1 U1.3(IN1)
CTRL.B: R2.1 U1.2(IN2)
GND: C1.2 C2.2 C3.- C5.2 R1.2 R2.2 R3.2 U1.1(GND) U1.7(PGND) U1.THERMAL(PAD)
ILIM: R3.1 U1.4(ILIM)
MOT.OUT+: C4.2 C5.1 U1.6(OUT1)
MOT.OUT-: U1.8(OUT2)
MOT.VIN: C1.1 L1.2
VM: C2.1 C3.+ C4.1 L1.1 U1.5(VM)

### Notes on the sheet
- [note1]
- [note1]: PfaffM(sic): No point in making separate GND zones, focus on preventing slit antennae

### Library data of the parts
C1 C2 = rcl:C-EU: CAPACITOR, European symbol
C3 = rcl:CPOL-EU: POLARIZED CAPACITOR, European symbol
C4 C5 = resistor:C-EU: CAPACITOR, European symbol
L1 = rcl:L-EU: INDUCTOR, European symbol
R1-R3 = rcl:R-EU_: RESISTOR, European symbol
U1 = kitt.ic:DRV8871

## Module SEN-GYRO1
Ports: +3V3(pwr) GND(pwr) SCL(io) SDA(io) INT1_AG(out)
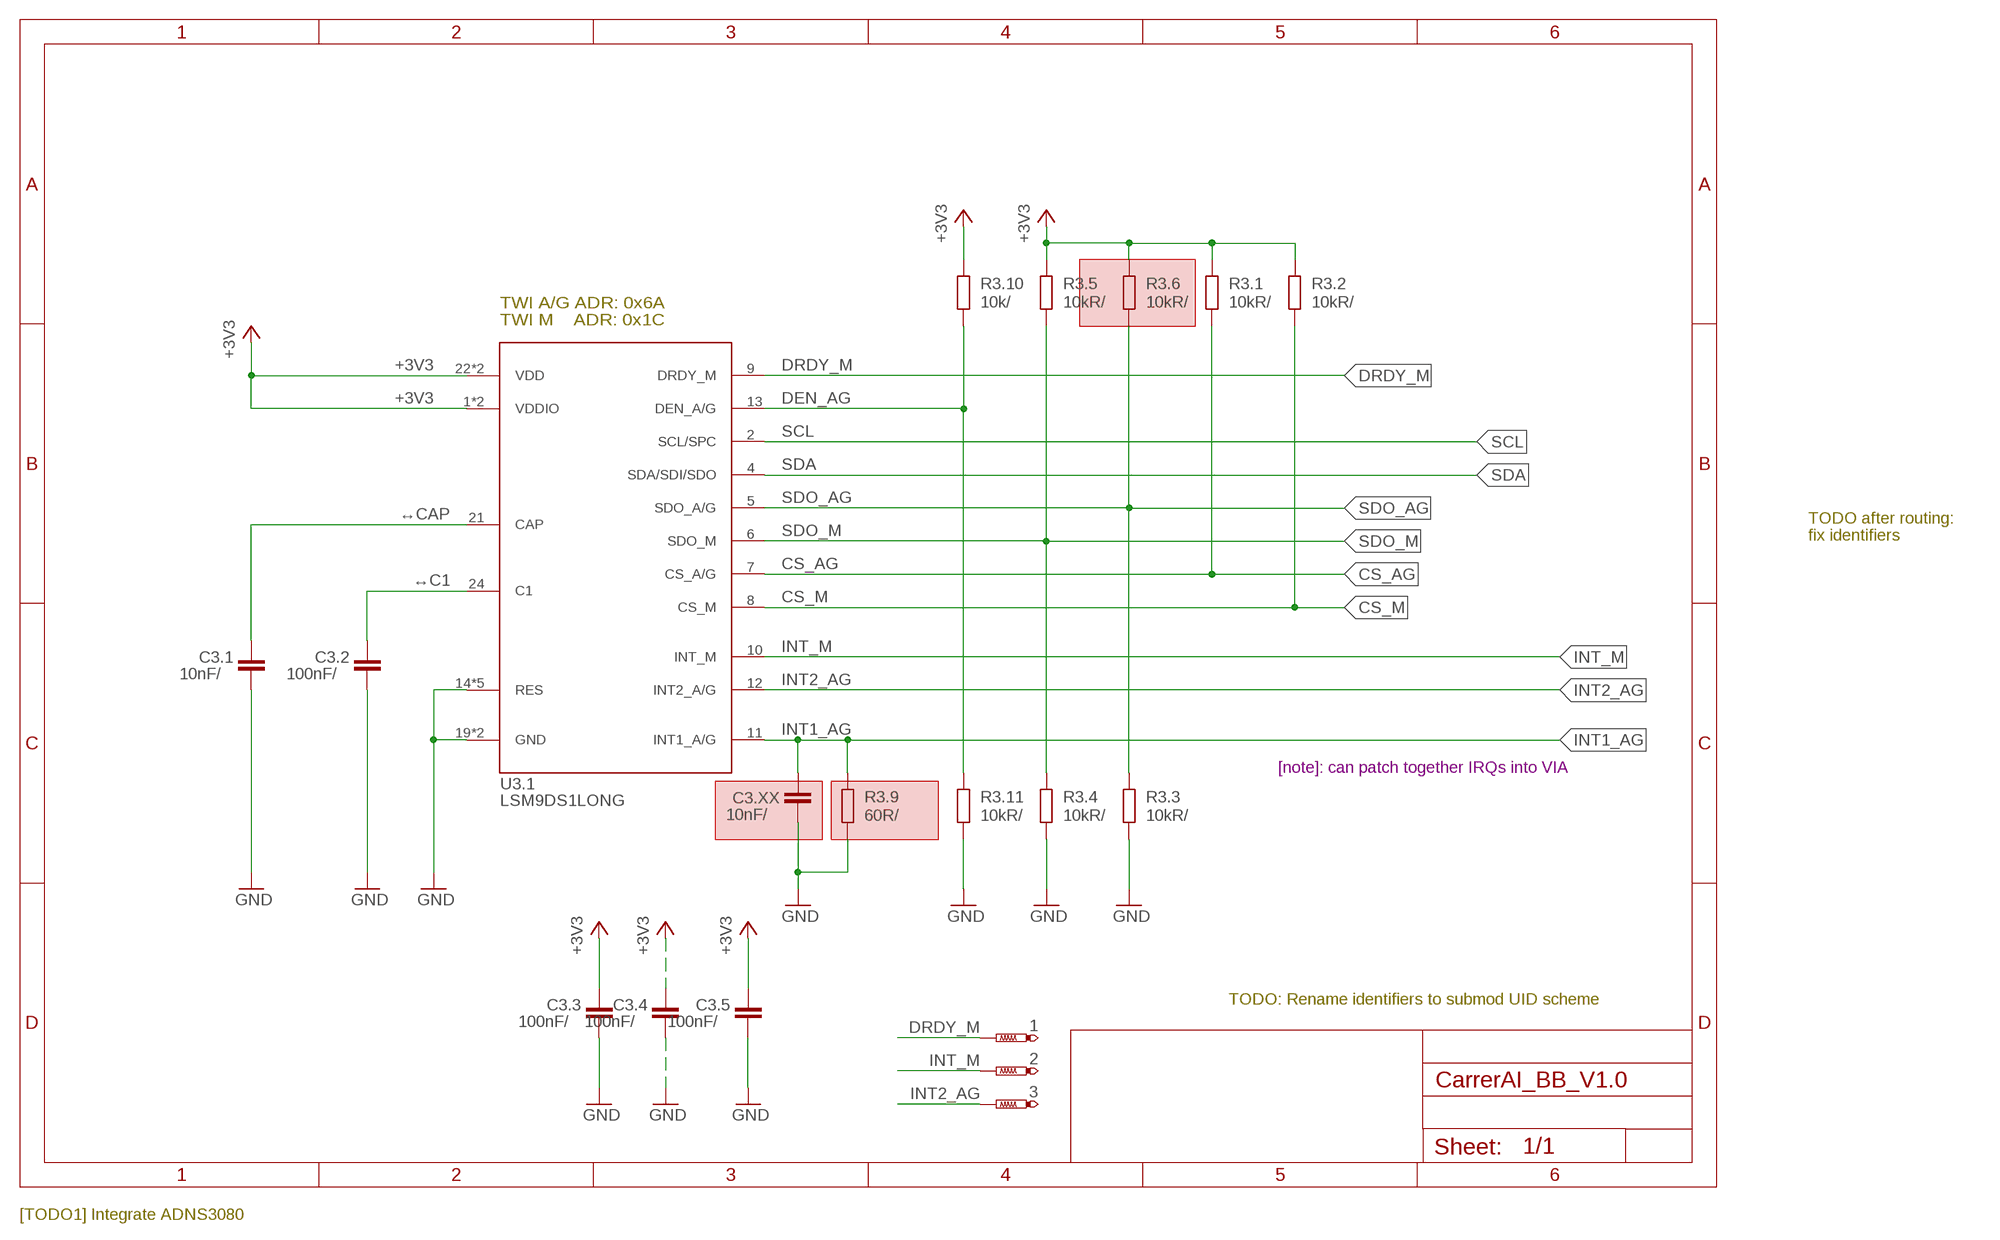
[diagram p5: schematic, module SEN-GYRO1, sheet 1]

### Parts
C3.1  10nF/⇤  C-EUC0805  [C0805]
C3.2  100nF/⇤  C-EUC0402K  [C0402K]
C3.3  100nF/⇤  C-EUC0402K  [C0402K]
C3.4  100nF/⇤  C-EUC0402K  [C0402K]
C3.5  100nF/⇤  C-EUC0402K  [C0402K]
C3.XX  10nF/⇤  C-EUC0805  [C0805]
R3.1  10kR/⎒  R-EU_R0402  [R0402]
R3.2  10kR/⎒  R-EU_R0402  [R0402]
R3.3  10kR/⎑  R-EU_R0201  [R0201]
R3.4  10kR/⎑  R-EU_R0201  [R0201]
R3.5  10kR/⎒  R-EU_R0402  [R0402]
R3.6  10kR/⎒  R-EU_R0402  [R0402]
R3.9  60R/⇤  R-EU_R0603  [R0603]
R3.10  10k/⎒  R-EU_R0402  [R0402]
R3.11  10kR/⎑  R-EU_R0201  [R0201]
U3.1  LSM9DS1LONG  [KITT.IC_LGA-24]
☇1  PTR1TP06R  [TP06R]
☇2  PTR1TP06R  [TP06R]
☇3  PTR1TP06R  [TP06R]

### Nets
+3V3: C3.3.1 C3.4.1 C3.5.1 R3.1.1 R3.2.1 R3.5.1 R3.6.1 R3.10.1 U3.1.1(VDDIO) U3.1.3(VDDIO) U3.1.22(VDD) U3.1.23(VDD)
CS_AG: R3.1.2 U3.1.7(CS_A/G)
CS_M: R3.2.2 U3.1.8(CS_M)
DEN_AG: R3.10.2 R3.11.1 U3.1.13(DEN_A/G)
DRDY_M: U3.1.9(DRDY_M) ☇1.TP
GND: C3.1.2 C3.2.2 C3.3.2 C3.4.2 C3.5.2 C3.XX.2 R3.3.2 R3.4.2 R3.9.2 R3.11.2 U3.1.14(RES) U3.1.15(RES) U3.1.16(RES) U3.1.17(RES) U3.1.18(RES) U3.1.19(GND) U3.1.20(GND)
INT1_AG: C3.XX.1 R3.9.1 U3.1.11(INT1_A/G)
INT2_AG: U3.1.12(INT2_A/G) ☇3.TP
INT_M: U3.1.10(INT_M) ☇2.TP
SCL: U3.1.2(SCL/SPC)
SDA: U3.1.4(SDA/SDI/SDO)
SDO_AG: R3.3.1 R3.6.2 U3.1.5(SDO_A/G)
SDO_M: R3.4.1 R3.5.2 U3.1.6(SDO_M)
↔C1: C3.2.1 U3.1.24(C1)
↔CAP: C3.1.1 U3.1.21(CAP)

### Notes on the sheet
- TWI A/G ADR: 0x6A
  TWI M    ADR: 0x1C
- TODO after routing:
  fix identifiers
- [note]: can patch together IRQs into VIA
- TODO: Rename identifiers to submod UID scheme
- [TODO1] Integrate ADNS3080

### Library data of the parts
C3.1-C3.5 C3.XX = rcl:C-EU: CAPACITOR, European symbol
R3.1 R3.2 = resistor:R-EU_: RESISTOR, European symbol
R3.3-R3.6 R3.9-R3.11 = rcl:R-EU_: RESISTOR, European symbol
U3.1 = kitt.ic:LSM9DS1
☇1-☇3 = testpad:PTR1: TEST PIN

## Module POW-DRV01
Ports: COM(io) EN1(io) EN0(io) OD0(io) OD1(io)
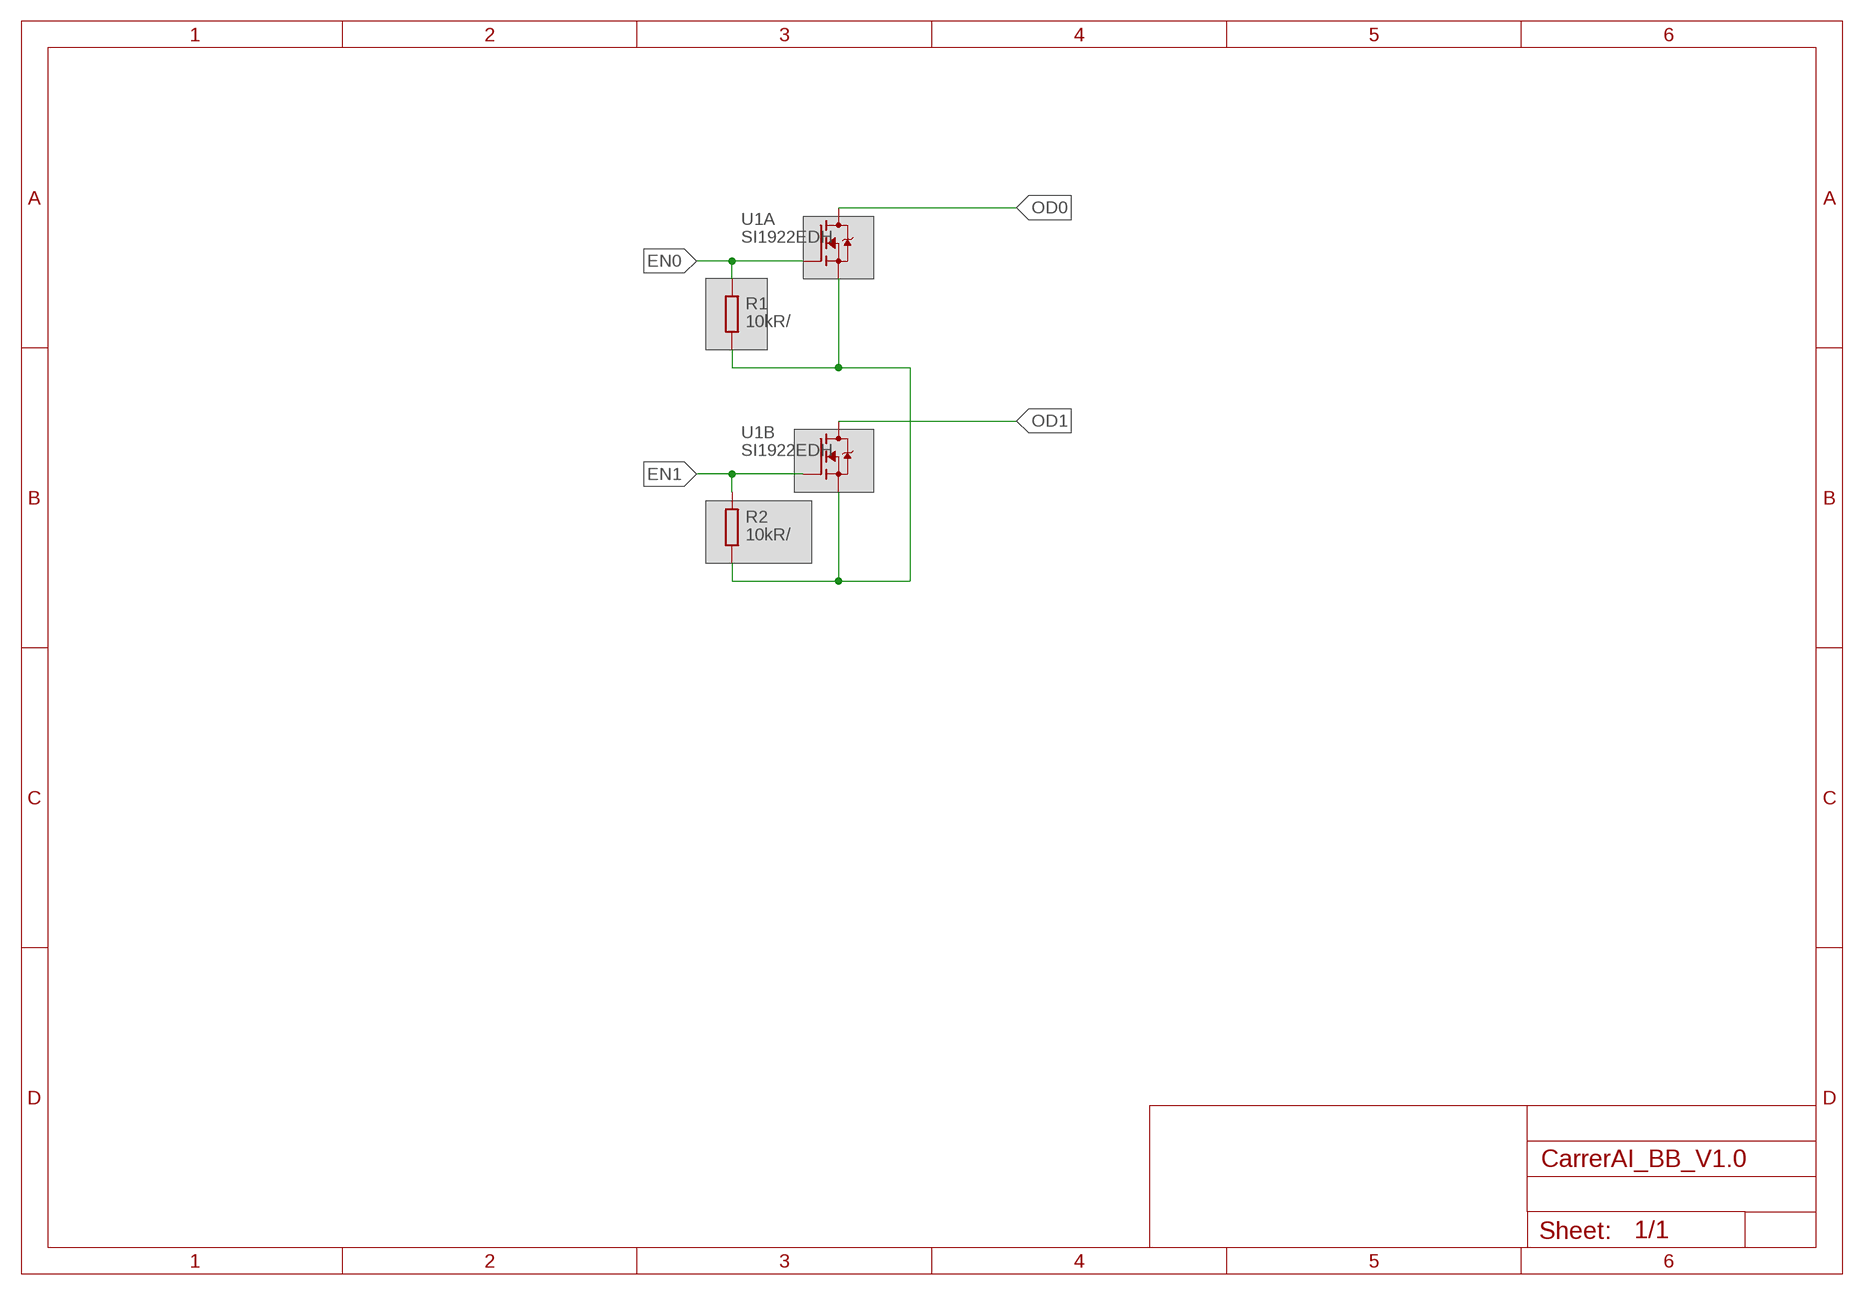
[diagram p6: schematic, module POW-DRV01, sheet 1]

### Parts
R1  10kR/⎑  R-EU_R0402  [R0402]
R2  10kR/⎑  R-EU_R0402  [R0402]
U1  SI1922EDH  [SC70-6]

### Nets
COM: R1.1 R2.1 U1.1(A:S) U1.4(B:S)
EN0: R1.2 U1.2(A:G)
EN1: R2.2 U1.5(B:G)
OD0: U1.6(A:D)
OD1: U1.3(B:D)

### Library data of the parts
R1 R2 = rcl:R-EU_: RESISTOR, European symbol
U1 = kitt.ic:SI1922EDH

## Module X1-TRACKBOARD3080
Ports: !CS0(io) SCLK(io) MOSI(io) MISO(io) !CS1(io) !INT(io) SDA(io) SCL(io) GND(pwr) +3V3(pwr) +5V(pwr) VSYS(pwr) V++(pwr) ADC0(io) ADC1(io) !RESET(io) MRXS(io) MTXS(io) V+++(pwr)

### Sheet 1 of 2
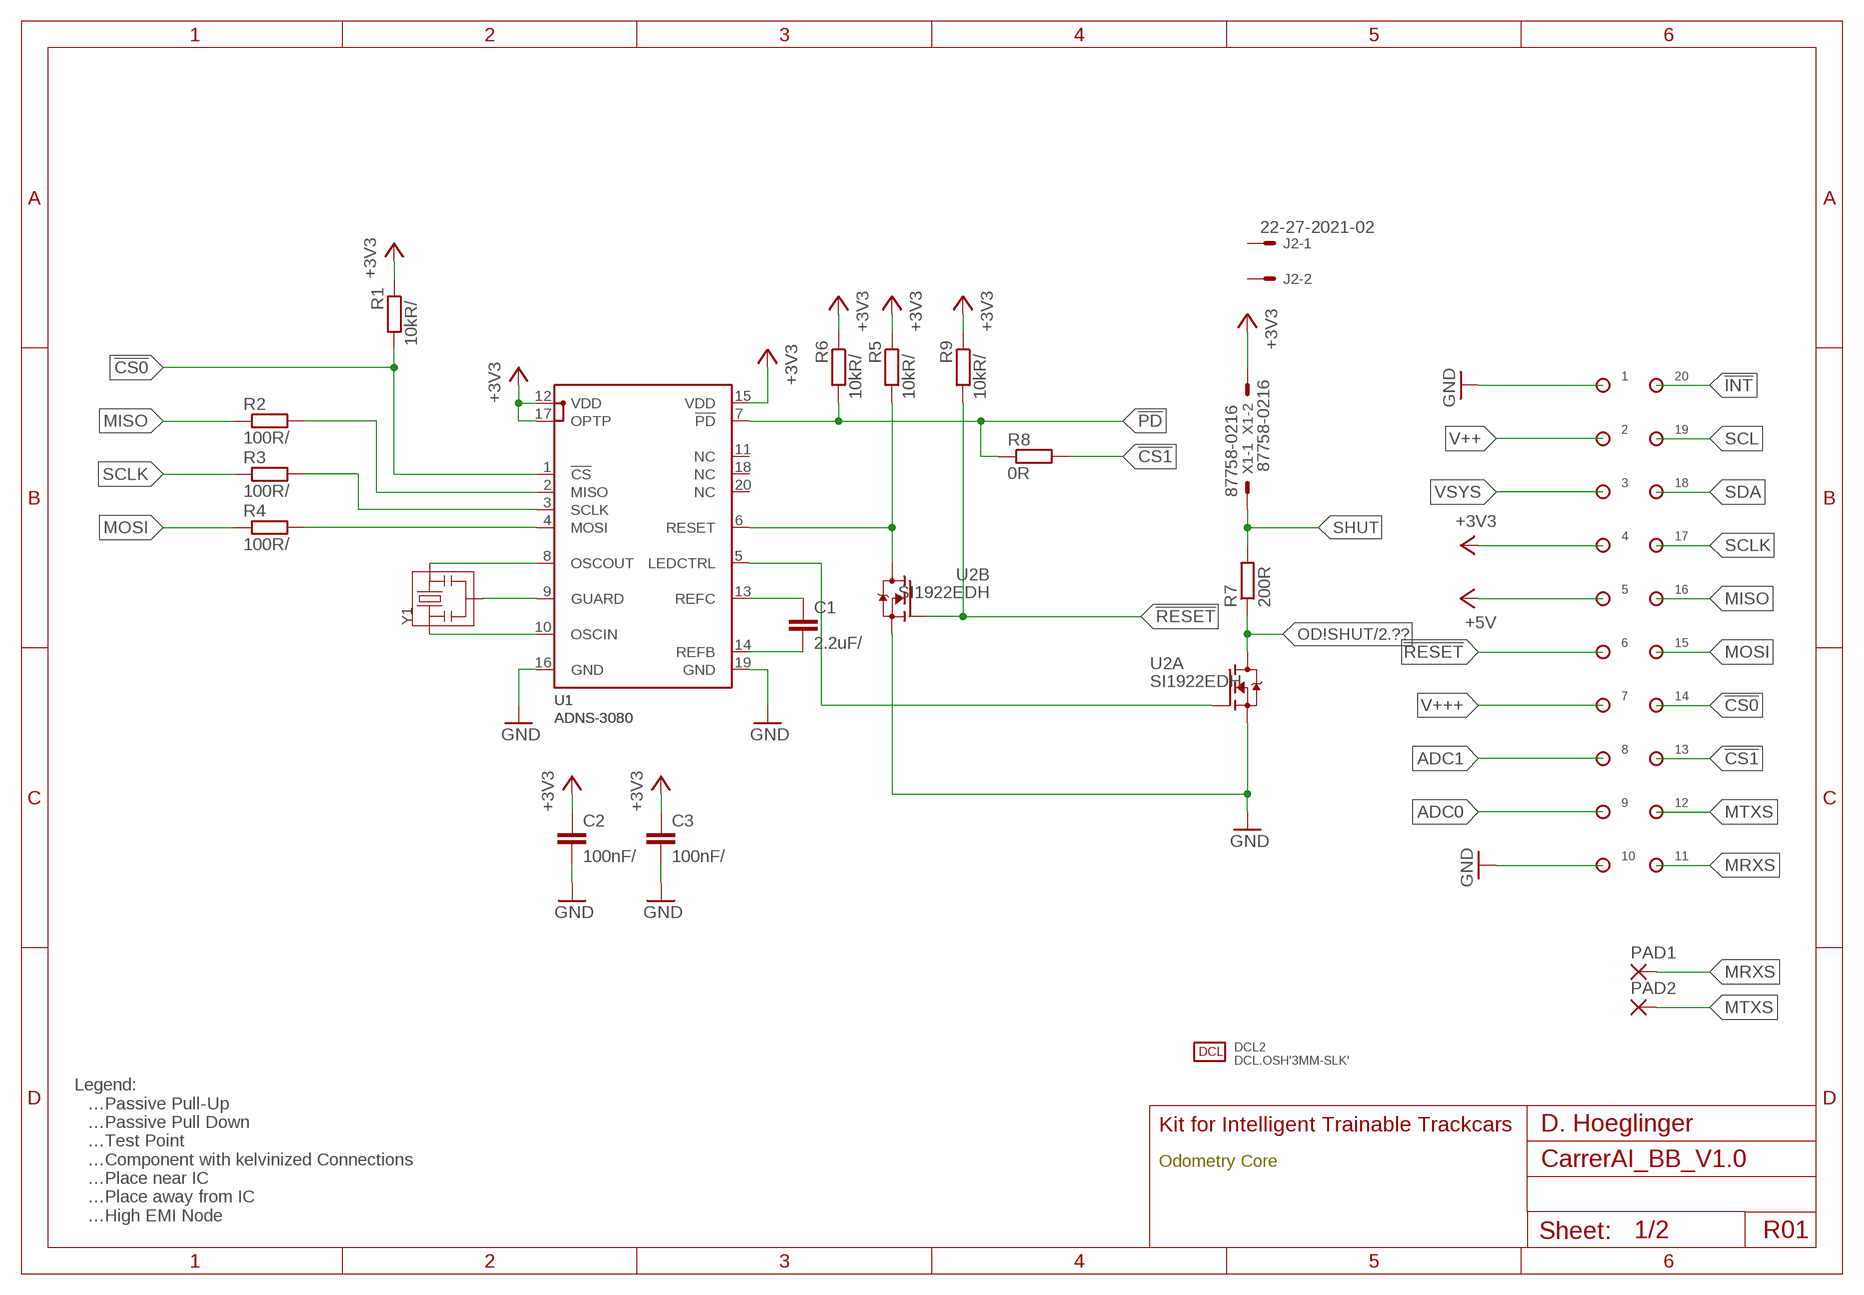
[diagram p7: schematic, module X1-TRACKBOARD3080, sheet 1]

#### Parts
C1  2.2uF/⇤  C-EUC1608  [C1608]
C2  100nF/⇤  C-EUC0805K  [C0805K]
C3  100nF/⇤  C-EUC0805K  [C0805K]
DCL2  DCL.OSH'3MM-SLK'  [DCL.LOGO-OSH.3MM]
J2  22-27-2021-02  [6410-02]
PAD1  SMD2  [SMD1,27-2,54]
PAD2  SMD2  [SMD1,27-2,54]
R1  10kR/⎒  R-EU_MELF0102R  [MINI_MELF-0102R]
R2  100R/⇤  R-EU_MELF0102R  [MINI_MELF-0102R]
R3  100R/⇤  R-EU_MELF0102R  [MINI_MELF-0102R]
R4  100R/⇤  R-EU_MELF0102R  [MINI_MELF-0102R]
R5  10kR/⎒  R-EU_MELF0102R  [MINI_MELF-0102R]
R6  10kR/⎒  R-EU_MELF0102R  [MINI_MELF-0102R]
R7  200R  R-EU_R0402  [R0402]
R8  0R  R-EU_R0201  [R0201]
R9  10kR/⎒  R-EU_R0402  [R0402]
U1  ADNS-3080  [ADNS-3080]
U2  SI1922EDH  [SC70-6]
X1  87758-0216  [87758-0216]
Y1  24MHz  RESON  [RESON-SMD]
⌁1  SINGLEPAD40MIL-BREAK  [PAD40MIL.BREAK]
⌁2  SINGLEPAD40MIL-BREAK  [PAD40MIL.BREAK]
⌁3  SINGLEPAD40MIL-BREAK  [PAD40MIL.BREAK]
⌁4  SINGLEPAD40MIL-BREAK  [PAD40MIL.BREAK]
⌁5  SINGLEPAD40MIL-BREAK  [PAD40MIL.BREAK]
⌁6  SINGLEPAD40MIL-BREAK  [PAD40MIL.BREAK]
⌁7  SINGLEPAD40MIL-BREAK  [PAD40MIL.BREAK]
⌁8  SINGLEPAD40MIL-BREAK  [PAD40MIL.BREAK]
⌁9  SINGLEPAD40MIL-BREAK  [PAD40MIL.BREAK]
⌁10  SINGLEPAD40MIL-BREAK  [PAD40MIL.BREAK]
⌁11  SINGLEPAD40MIL-BREAK  [PAD40MIL.BREAK]
⌁12  SINGLEPAD40MIL-BREAK  [PAD40MIL.BREAK]
⌁13  SINGLEPAD40MIL-BREAK  [PAD40MIL.BREAK]
⌁14  SINGLEPAD40MIL-BREAK  [PAD40MIL.BREAK]
⌁15  SINGLEPAD40MIL-BREAK  [PAD40MIL.BREAK]
⌁16  SINGLEPAD40MIL-BREAK  [PAD40MIL.BREAK]
⌁17  SINGLEPAD40MIL-BREAK  [PAD40MIL.BREAK]
⌁18  SINGLEPAD40MIL-BREAK  [PAD40MIL.BREAK]
⌁19  SINGLEPAD40MIL-BREAK  [PAD40MIL.BREAK]
⌁20  SINGLEPAD40MIL-BREAK  [PAD40MIL.BREAK]

#### Nets
!CS0: R1.2 U1.1(!CS) ⌁14.P$1
!CS1: R8.2 ⌁13.P$1
!INT: ⌁20.P$1
!PD: R6.2 R8.1 U1.7(!PD)
!RESET: R9.2 U2.5(B:G) ⌁6.P$1
+3V3: C2.1 C3.1 R1.1 R5.1 R6.1 R9.1 U1.12(VDD) U1.15(VDD) U1.17(OPTP) X1.2 ⌁4.P$1 ; also sheet 2
+5V: ⌁5.P$1
ADC0: ⌁9.P$1
ADC1: ⌁8.P$1
GND: C2.2 C3.2 U1.16(GND) U1.19(GND) U2.1(A:S) U2.4(B:S) ⌁1.P$1 ⌁10.P$1
LEDCTRL: U1.5(LEDCTRL) U2.2(A:G)
MISO: R2.1 ⌁16.P$1
MOSI: R4.1 ⌁15.P$1
MRXS: PAD1.1(P) ⌁11.P$1
MTXS: PAD2.1(P) ⌁12.P$1
N$5: C1.1 U1.13(REFC)
N$6: C1.2 U1.14(REFB)
OD\!SHUT: R7.1 U2.6(A:D) ; also sheet 2
RST: R5.2 U1.6(RESET) U2.3(B:D)
SCL: ⌁19.P$1
SCLK: R3.1 ⌁17.P$1
SDA: ⌁18.P$1
SHUT: R7.2 X1.1
U1.GUARD: U1.9(GUARD) Y1.2
U1.MISO: R2.2 U1.2(MISO)
U1.MOSI: R4.2 U1.4(MOSI)
U1.OSCIN✳: U1.10(OSCIN) Y1.1
U1.OSCOUT✳: U1.8(OSCOUT) Y1.3
U1.SCLK: R3.2 U1.3(SCLK)
V++: ⌁2.P$1
V+++: ⌁7.P$1
VSYS: ⌁3.P$1
Unconnected: J2.1 J2.2 U1.11(NC) U1.18(NC) U1.20(NC)

#### Notes on the sheet
- Legend:
  ⎒…Passive Pull-Up
  ⎑…Passive Pull Down
  ☇…Test Point
  ⚻…Component with kelvinized Connections
  ⇤…Place near IC
  ↦…Place away from IC
  ✳…High EMI Node
- Kit for Intelligent Trainable Trackcars | D. Hoeglinger
- Odometry Core
- R01

### Sheet 2 of 2
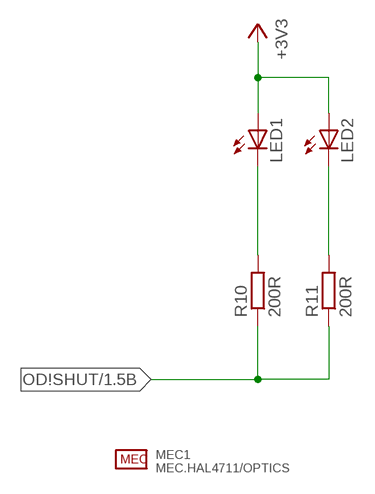
[diagram p8: schematic, module X1-TRACKBOARD3080, sheet 2]

#### Parts
LED1  LEDLZR181  [LZR181]
LED2  LEDLZR181  [LZR181]
MEC1  MEC.HAL4711/OPTICS  [MEC.HAL4711]
R10  200R  R-EU_R0402  [R0402]
R11  200R  R-EU_R0402  [R0402]

#### Nets
+3V3: LED1.A LED2.A ; also sheet 1
N$1: LED2.K(C) R11.2
N$2: LED1.K(C) R10.2
OD\!SHUT: R10.1 R11.1 ; also sheet 1

### Library data of the parts
C1-C3 = rcl:C-EU: CAPACITOR, European symbol
DCL2 = kitt.refs:DCL.OSH
J2 = con-molex:22-?-02: CONNECTOR wire to board 2.54 mm (.1 inch) pitch header; OC_FARNELL: unknown; OC_NEWARK: unknown
LED1 LED2 = led:LED: LED OSRAM: - CHIPLED LG R971, LG N971, LY N971, LG Q971, LY Q971, LO R971, LY R971 LH N974, LH R974 LS Q976, LO Q976, LY Q976 LO Q996 - Hyper CHIPLED LW Q18S LB Q993, LB Q99A, LB R99A - SideLED LS A670, LO A670, LY A670, LG A670, LP A670 LB A673, LV A673, LT A673, LW A673 LH A674 LY A675 LS A676, LA A676, LO A676, LY A676, LW A676 LS A679, LY A679, LG A679 - Hyper Micro SIDELED® LS Y876, LA Y876, LO Y876, LY Y876 LT Y87S - SmartLED LW L88C, LW L88S LB L89C, LB L89S, LG L890 LS L89K, LO L89K, LY L89K LS L896, LA L896, LO L896, LY L896 - TOPLED LS T670, LO T670, LY T670, LG T670, LP T670 LSG T670, LSP T670, LSY T670, LOP T670, LYG T670 LG T671, LOG T671, LSG T671 LB T673, LV T673, LT T673, LW T673 LH T674 LS T676, LA T676, LO T676, LY T676, LB T676, LH T676, LSB T676, LW T676 LB T67C, LV T67C, LT T67C, LS T67K, LO T67K, LY T67K, LW E67C LS E67B, LA E67B, LO E67B, LY E67B, LB E67C, LV E67C, LT E67C LW T67C LS T679, LY T679, LG T679 LS T770, LO T770, LY T770, LG T770, LP T770 LB T773, LV T773, LT T773, LW T773 LH T774 LS E675, LA E675, LY E675, LS T675 LS T776, LA T776, LO T776, LY T776, LB T776 LHGB T686 LT T68C, LB T68C - Hyper Mini TOPLED® LB M676 - Mini TOPLED Santana® LG M470 LS M47K, LO M47K, LY M47K Source: http://www.osram.convergy.de LUXEON: - LUMILED® LXK2-PW12-R00, LXK2-PW12-S00, LXK2-PW14-U00, LXK2-PW14-V00 LXK2-PM12-R00, LXK2-PM12-S00, LXK2-PM14-U00 LXK2-PE12-Q00, LXK2-PE12-R00, LXK2-PE12-S00, LXK2-PE14-T00, LXK2-PE14-U00 LXK2-PB12-K00, LXK2-PB12-L00, LXK2-PB12-M00, LXK2-PB14-N00, LXK2-PB14-P00, LXK2-PB14-Q00 LXK2-PR12-L00, LXK2-PR12-M00, LXK2-PR14-Q00, LXK2-PR14-R00 LXK2-PD12-Q00, LXK2-PD12-R00, LXK2-PD12-S00 LXK2-PH12-R00, LXK2-PH12-S00 LXK2-PL12-P00, LXK2-PL12-Q00, LXK2-PL12-R00 Source: www.luxeon.com KINGBRIGHT: KA-3528ASYC Source: www.kingbright.com
MEC1 = kitt.refs:MEC.HAL4711/OPTICS
PAD1 PAD2 = wirepad:SMD2: SMD PAD
R1-R11 = rcl:R-EU_: RESISTOR, European symbol
U1 = kitt.ic:ADNS-3080
U2 = kitt.ic:SI1922EDH
X1 = con-molex:87758-0216: 2 Pin - 2mm Dual Row Single Wafer, Vertical T/H HDR Source: http://www.molex.com/pdm_docs/sd/877580616_sd.pdf; MPN: 87758-0216; OC_FARNELL: unknown; OC_NEWARK: 94M1513
Y1 = Ai_Passives:RESON
⌁1-⌁20 = kitt.con:SINGLEPAD

## Module POW-DDC3350
Ports: VIN(pwr) VOUT(pwr) INACT(out) EN(in) PGND(pwr) AGND(pwr)
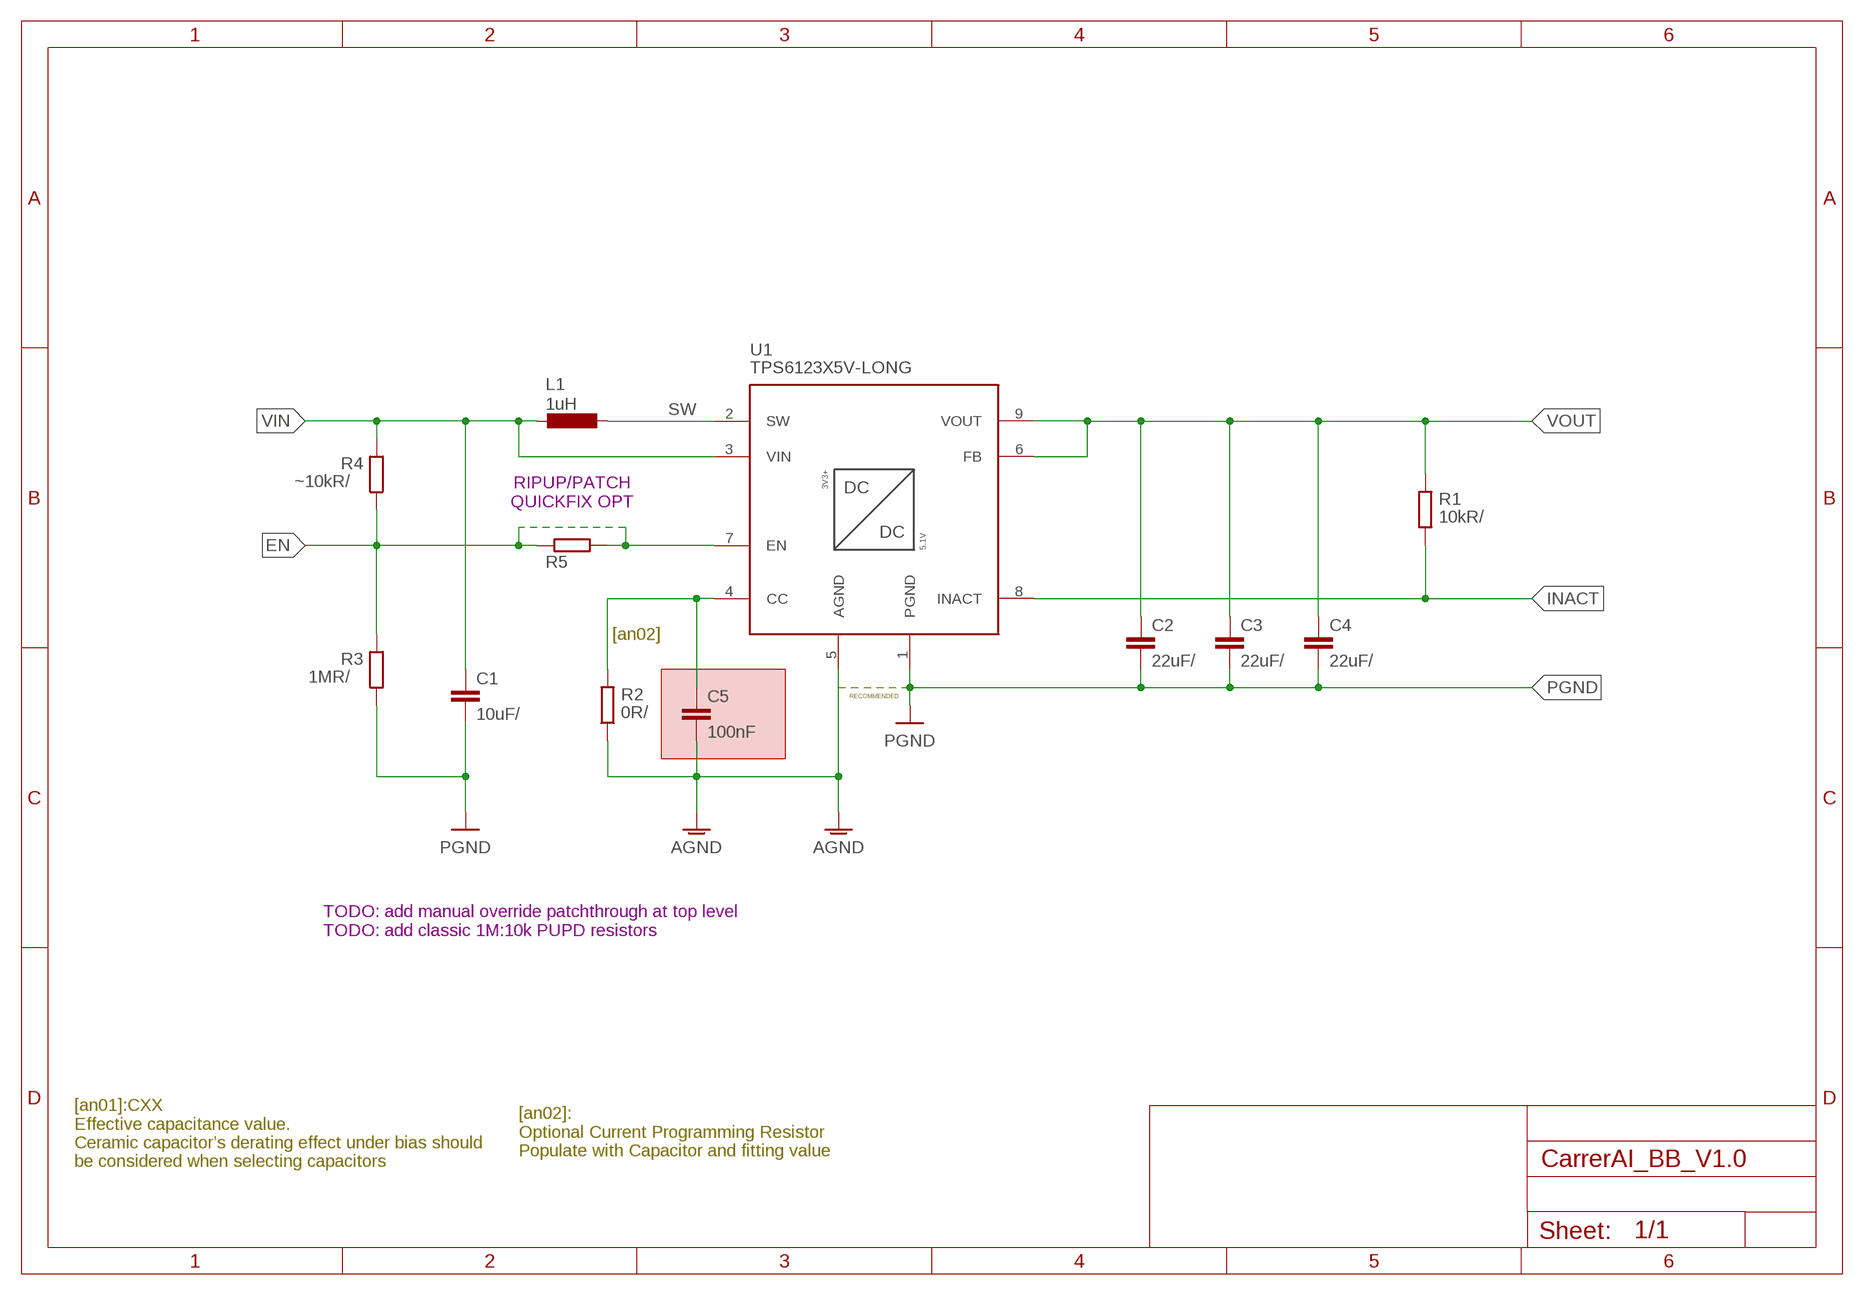
[diagram p9: schematic, module POW-DDC3350, sheet 1]

### Parts
C1  10uF/⇤  C-EUC0805K  [C0805K]
C2  22uF/⇤  C-EUC0805K  [C0805K]
C3  22uF/⇤  C-EUC0805K  [C0805K]
C4  22uF/⇤  C-EUC0805K  [C0805K]
C5  100nF  C-EUC0805K  [C0805K]
L1  1uH  NRS8030XX  [TAIYO-YUDEN.NRS8030T4R7MJGJ]
R1  10kR/⎒  R-EU_R0805W  [R0805W]
R2  0R/⎵  R-EU_R0402  [R0402]
R3  1MR/⎵  R-EU_R0402  [R0402]
R4  ~10kR/⎵  R-EU_R0402  [R0402]
R5  R-EU_R0201  [R0201]
U1  TPS6123X5V-LONG  [9-VQFN-HR_LONG]

### Nets
AGND: C5.2 R2.1 U1.5(AGND)
CC: C5.1 R2.2 U1.4(CC)
EN: R3.2 R4.1 R5.1 R5.2 U1.7(EN)
INACT: R1.1 U1.8(INACT)
PGND: C1.2 C2.2 C3.2 C4.2 R3.1 U1.1(PGND)
VIN: C1.1 L1.1 R4.2 U1.3(VIN)
VOUT: C2.1 C3.1 C4.1 R1.2 U1.6(FB) U1.9(VOUT)
✳SW: L1.2 U1.2(SW)

### Notes on the sheet
- RIPUP/PATCH
  QUICKFIX OPT
- [an02]
- RECOMMENDED
- TODO: add manual override patchthrough at top level
  TODO: add classic 1M:10k PUPD resistors
- [an02]: 
  Optional Current Programming Resistor
  Populate with Capacitor and fitting value
- [an01]:CXX
  Effective capacitance value.
  Ceramic capacitor’s derating effect under bias should
  be considered when selecting capacitors

### Library data of the parts
C1-C5 = rcl:C-EU: CAPACITOR, European symbol
L1 = kitt.psvs:NRS8030XX
R1 R5 = rcl:R-EU_: RESISTOR, European symbol
R2-R4 = resistor:R-EU_: RESISTOR, European symbol
U1 = kitt.ic:TPS6123X

## Module POW-1540
Ports: GND(pwr) ACTIVE(out) VSYS(pwr)

### Sheet 1 of 2
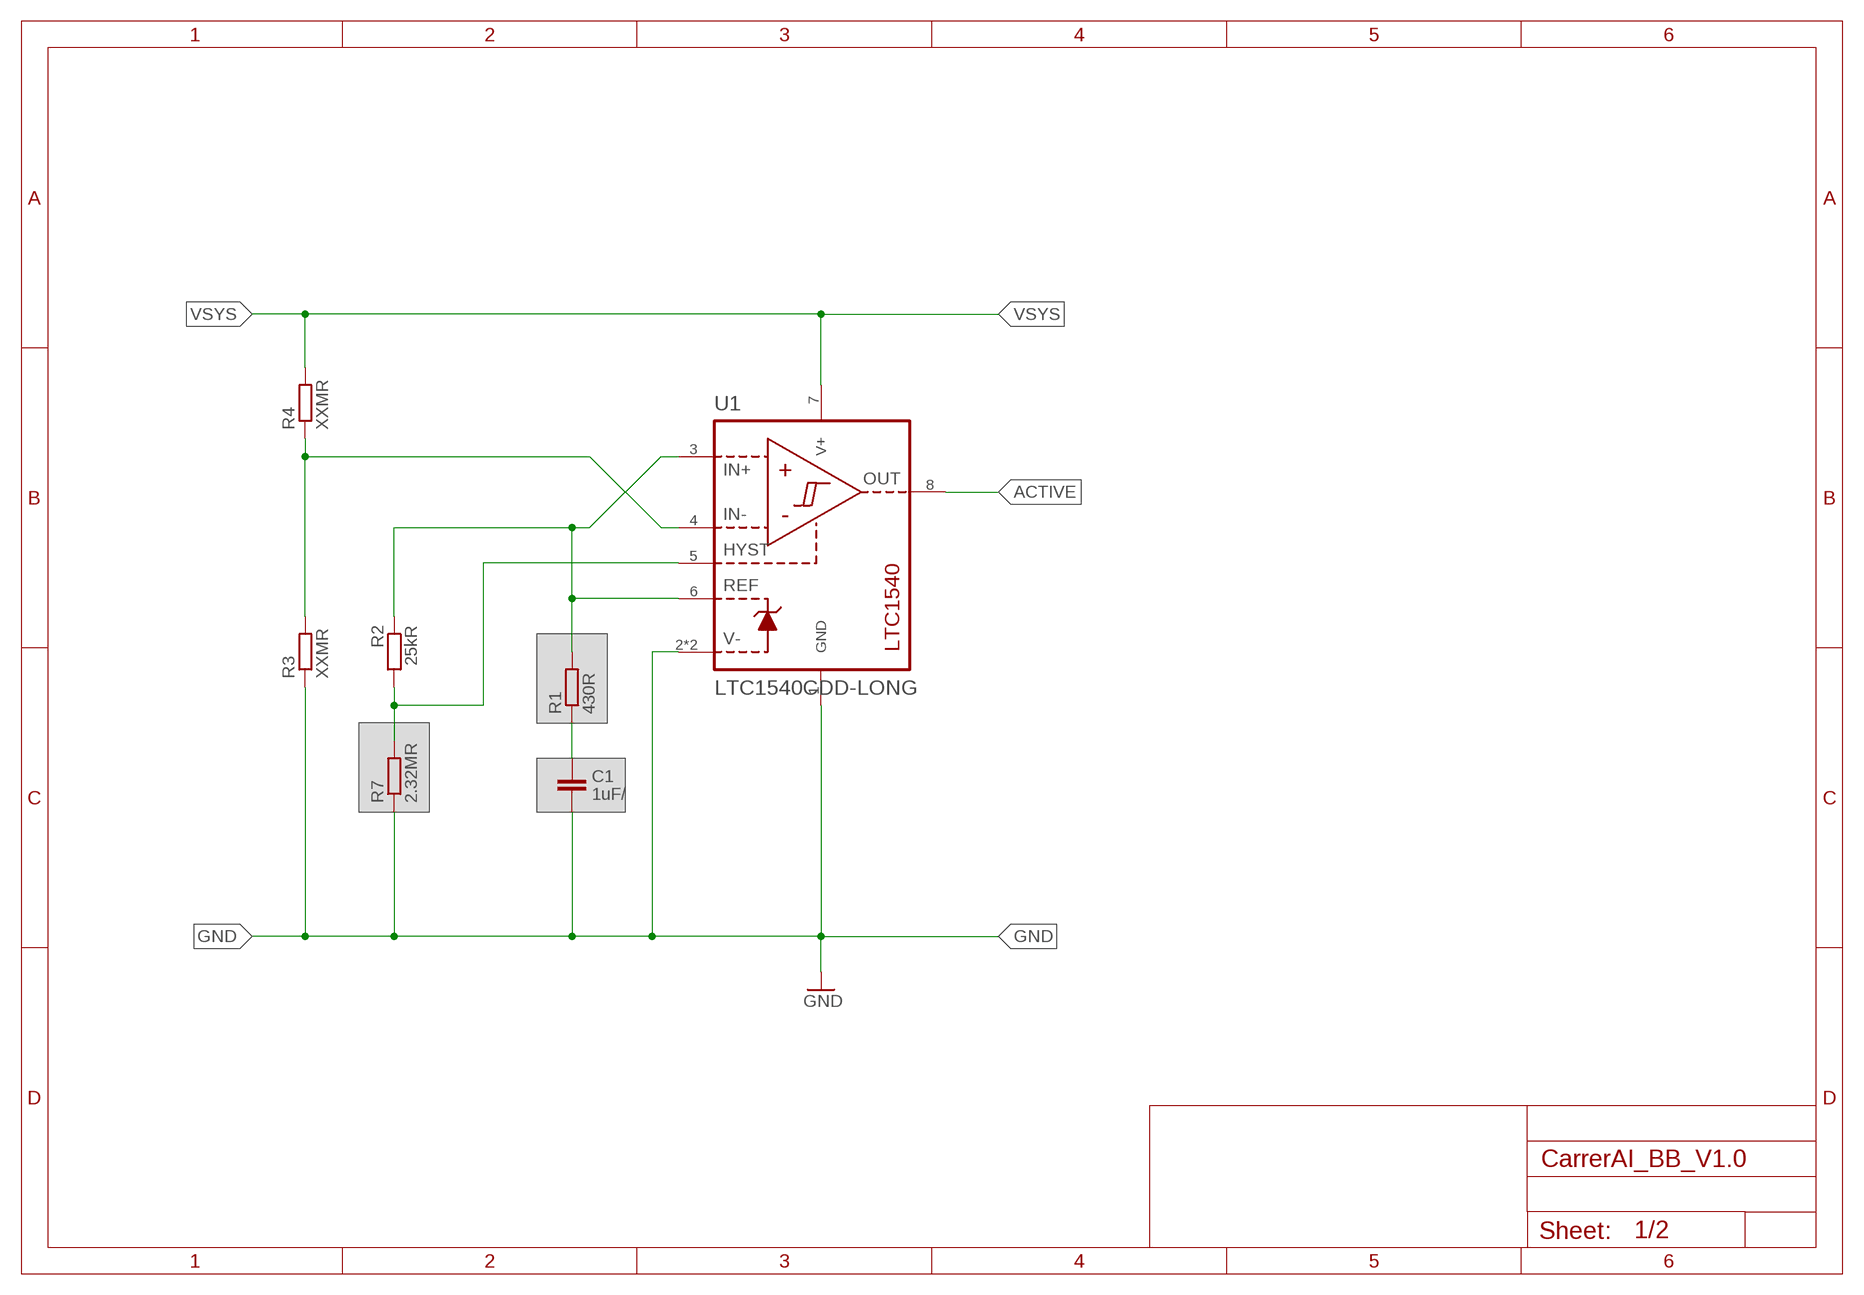
[diagram p10: schematic, module POW-1540, sheet 1]

#### Parts
C1  1uF/⇤  C-EUC0402K  [C0402K]
R1  430R  R-EU_R0402  [R0402]
R2  25kR  R-EU_R0402  [R0402]
R3  XXMR  R-EU_M0805  [M0805]
R4  XXMR  R-EU_M0805  [M0805]
R7  2.32MR  R-EU_R0402  [R0402]
U1  LTC1540CDD-LONG  [DFN-8_DD]

#### Nets
ACTIVE: U1.8(OUT)
COMP: C1.1 R1.1
GND: C1.2 R3.1 R7.1 U1.1(GND) U1.2(V-) U1.EP(V-)
HYST: R2.2 R7.2 U1.5(HYST)
IN+&REF: R1.2 R2.1 U1.3(IN+) U1.6(REF)
IN-: R3.2 R4.1 U1.4(IN-)
VSYS: R4.2 U1.7(V+)

### Sheet 2 of 2
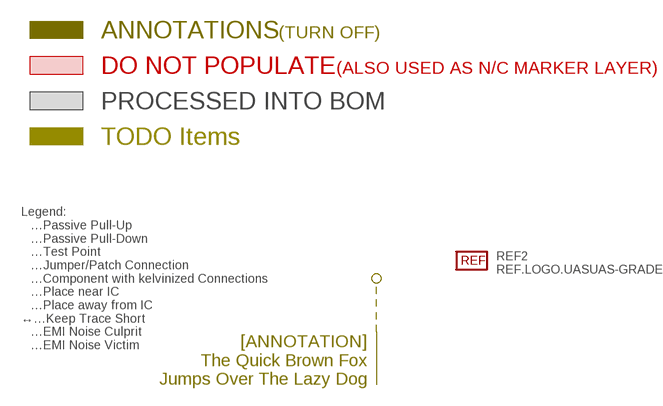
[diagram p11: schematic, module POW-1540, sheet 2]

#### Parts
REF2  REF.LOGO.UASUAS-GRADE  [DCL.LOGO.FHOOE-6MM-S]

#### Notes on the sheet
- ANNOTATIONS | (TURN OFF)
- DO NOT POPULATE | (ALSO USED AS N/C MARKER LAYER)
- PROCESSED INTO BOM
- TODO Items
- Legend:
  ⎒…Passive Pull-Up
  ⎑…Passive Pull-Down
  ☇…Test Point
  ☈…Jumper/Patch Connection
  ⚻…Component with kelvinized Connections
  ⇤…Place near IC
  ↦…Place away from IC
  ↔…Keep Trace Short
  ✳…EMI Noise Culprit
  ✧…EMI Noise Victim
- [ANNOTATION]
  The Quick Brown Fox
  Jumps Over The Lazy Dog

### Library data of the parts
C1 = rcl:C-EU: CAPACITOR, European symbol
R1-R4 R7 = rcl:R-EU_: RESISTOR, European symbol
REF2 = kitt.refs:REF.LOGO.UASUA
U1 = kitt.ic:LTC1540; CC: XYX17

## Module POW-DRV02
Ports: ODA(io) ODB(io) INA(io) INB(io) GND(io) V+(io) ENA(io) ENB(io)
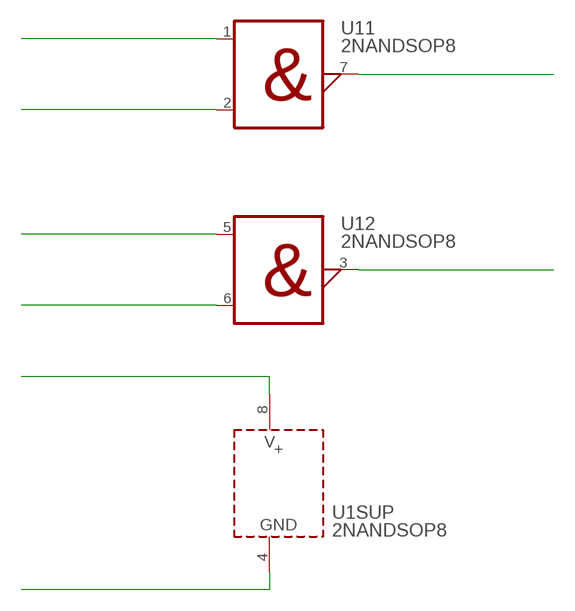
[diagram p12: schematic, module POW-DRV02, sheet 1]

### Parts
U1  2NANDSOP8  [SOP65P490X110-8N]

### Nets
ENA: U1.2(1:B)
ENB: U1.6(2:B)
GND: U1.4(SUP:GND)
INA: U1.1(1:A)
INB: U1.5(2:A)
ODA: U1.7(1:Y)
ODB: U1.3(2:Y)
V+: U1.8(SUP:V+)

### Library data of the parts
U1 = kitt.ic:2NAND

## Module XS-USB02
Ports: I<D+(in) I<D-(in) O>D+(out) O>D-(out) O>VBUS(pwr) P=5V(pwr) B-ID(io) P=VSYS(pwr) P=MGND(pwr) P=SGND(pwr)
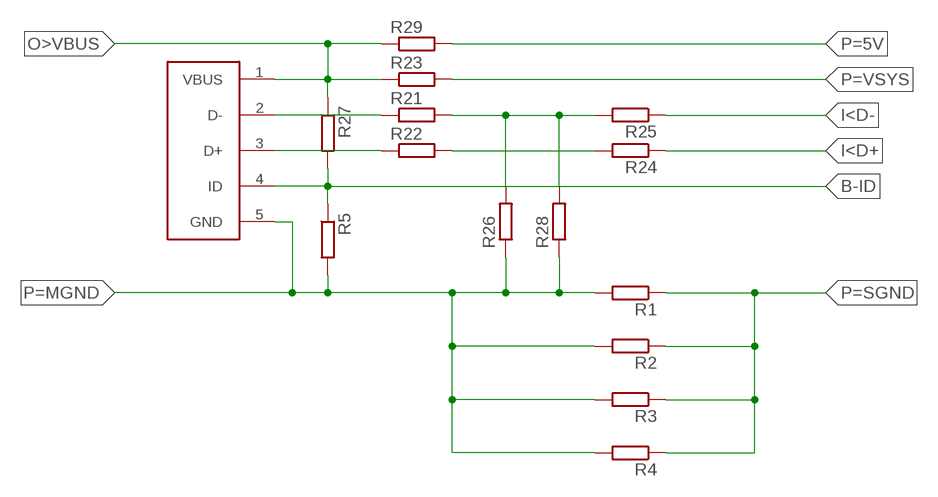
[diagram p13: schematic, module XS-USB02, sheet 1]

### Parts
R1  R-EU_R0201  [R0201]
R2  R-EU_R0201  [R0201]
R3  R-EU_R0201  [R0201]
R4  R-EU_R0201  [R0201]
R5  R-EU_R0201  [R0201]
R21  R-EU_R0201  [R0201]
R22  R-EU_R0201  [R0201]
R23  R-EU_R0201  [R0201]
R24  R-EU_R0201  [R0201]
R25  R-EU_R0201  [R0201]
R26  R-EU_R0201  [R0201]
R27  R-EU_R0201  [R0201]
R28  R-EU_R0201  [R0201]
R29  R-EU_R0201  [R0201]
U$2  1051330011  [POS-5]

### Nets
B-ID: R5.1 R27.2 U$2.4(ID)
I<D+: R24.1
I<D-: R25.1
N$5: R22.2 R24.2
N$6: R21.2 R25.2 R26.2 R28.2
O>D+: R22.1 U$2.3(D+)
O>D-: R21.1 U$2.2(D-)
O>VBUS: R23.1 R27.1 R29.1 U$2.1(VBUS)
P=5V: R29.2
P=MGND: R1.2 R2.2 R3.2 R4.2 R5.2 R26.1 R28.1 U$2.5(GND)
P=SGND: R1.1 R2.1 R3.1 R4.1
P=VSYS: R23.2

### Library data of the parts
R1-R5 R21-R29 = rcl:R-EU_: RESISTOR, European symbol
U$2 = kitt.con:1051330011: Conn Micro USB Type B RCP 5 POS 0.65mm Solder ST SMD 5 Terminal 1 Port Embossed T/R; AVAILABILITY: Good; DESCRIPTION: Conn Micro USB Type B RCP 5 POS 0.65mm Solder ST SMD 5 Terminal 1 Port Embossed T/R; MF: Molex; MP: 105133-0011; PACKAGE: None; PRICE: 0.60 USD

## Module POW-IPMC/ROK
Ports: V+(pwr) GND(io) RX(io) EN/BIAS(io)
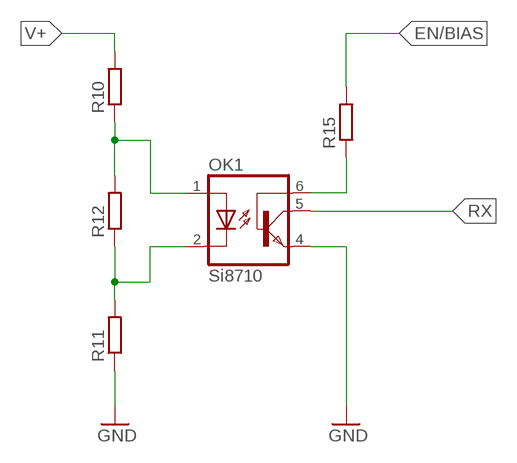
[diagram p14: schematic, module POW-IPMC/ROK, sheet 1]

### Parts
OK1  Si8710  4N35  [DIL06]
R10  R-EU_MELF0207R  [MINI_MELF-0207R]
R11  R-EU_MELF0207R  [MINI_MELF-0207R]
R12  R-EU_MELF0207R  [MINI_MELF-0207R]
R15  R-EU_R0402  [R0402]

### Nets
EN/BIAS: R15.2
GND: OK1.4(EMI) R11.1
N$1: OK1.2(C) R11.2 R12.1
N$2: OK1.1(A) R10.1 R12.2
N$5: OK1.6(BAS) R15.1
RX: OK1.5(COL)
V+: R10.2

### Library data of the parts
OK1 = optocoupler:4N35: MOTOROLA OPTO COUPLER; MF: FAIRCHILD SEMICONDUCTOR; MPN: 4N35; OC_FARNELL: 1328375; OC_NEWARK: 72K9946
R10-R12 R15 = rcl:R-EU_: RESISTOR, European symbol

## Module POW-IPMC/TOK
Ports: MRXS(io) V+++(io) GND(io)
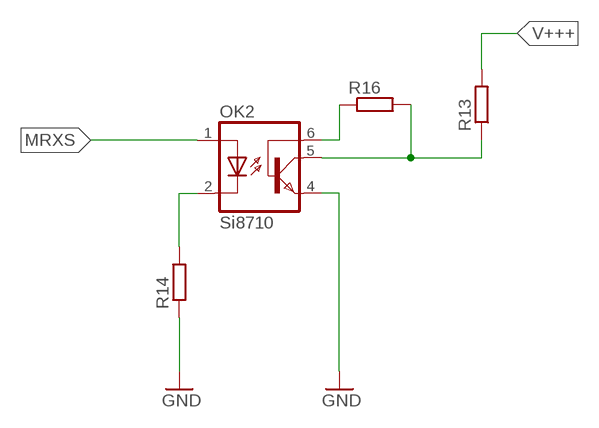
[diagram p15: schematic, module POW-IPMC/TOK, sheet 1]

### Parts
OK2  Si8710  4N35  [DIL06]
R13  R-EU_MELF0207R  [MINI_MELF-0207R]
R14  R-EU_MELF0207R  [MINI_MELF-0207R]
R16  R-EU_R0402  [R0402]

### Nets
GND: OK2.4(EMI) R14.1
MRXS: OK2.1(A)
N$1: OK2.5(COL) R13.1 R16.2
N$2: OK2.2(C) R14.2
N$3: OK2.6(BAS) R16.1
V+++: R13.2

### Library data of the parts
OK2 = optocoupler:4N35: MOTOROLA OPTO COUPLER; MF: FAIRCHILD SEMICONDUCTOR; MPN: 4N35; OC_FARNELL: 1328375; OC_NEWARK: 72K9946
R13 R14 R16 = rcl:R-EU_: RESISTOR, European symbol

## Module POW-IPMC
Ports: GND(pwr) V~IN(pwr) VF+OUT(pwr) V+PWR(pwr) COM.RRX(io) MON.VPWR(io) V~!IN(pwr)
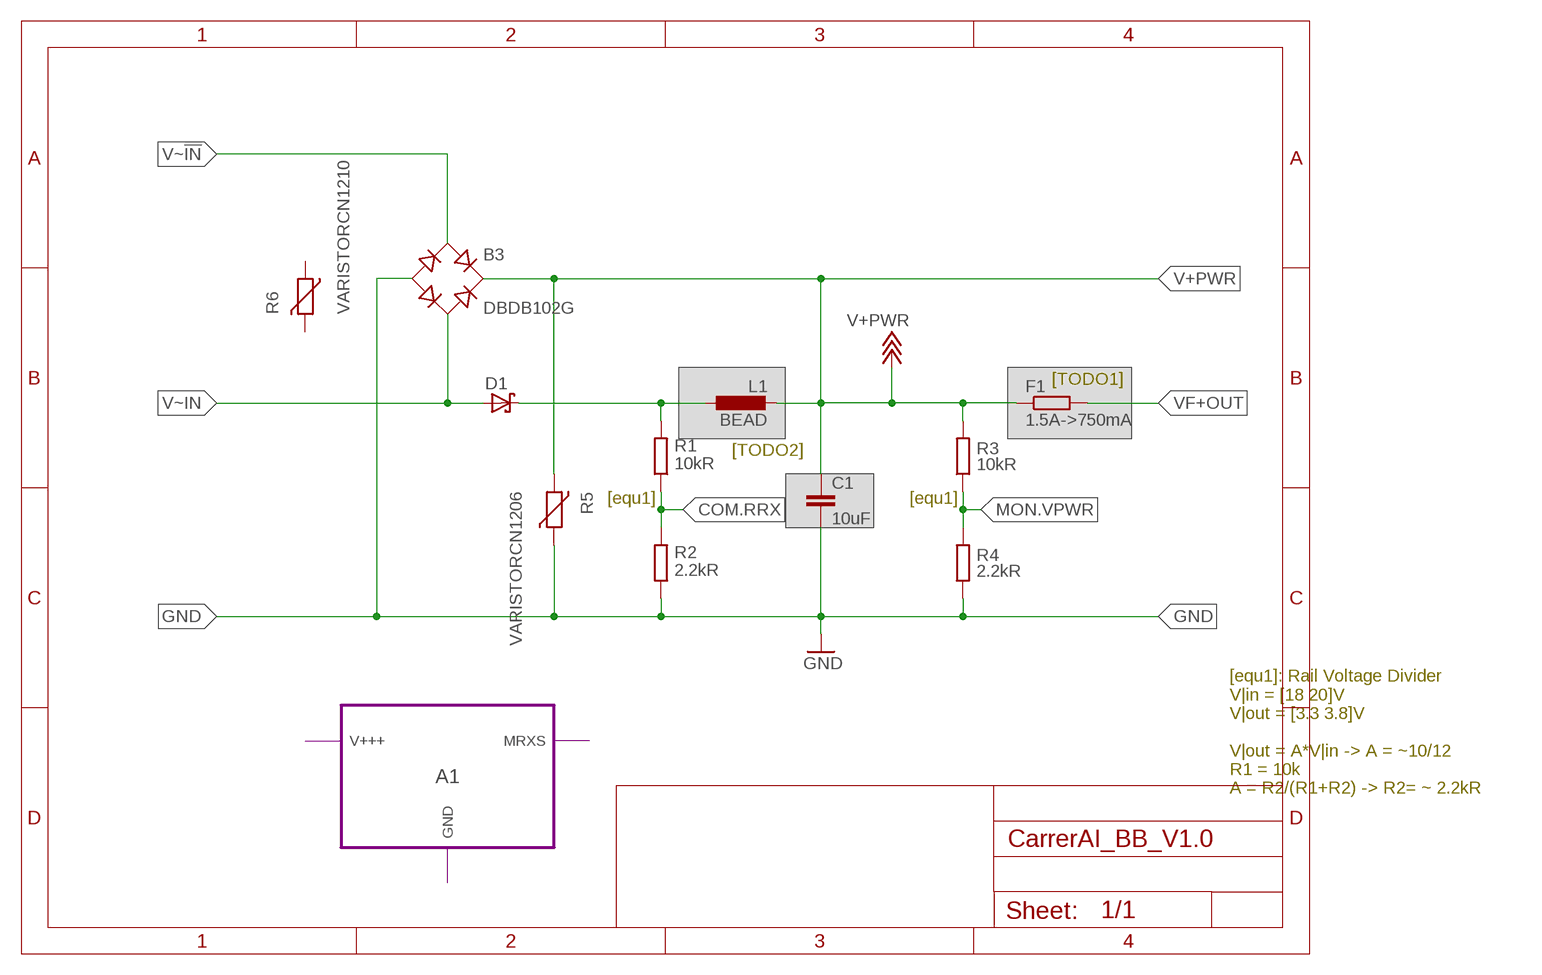
[diagram p16: schematic, module POW-IPMC, sheet 1]

### Parts
B3  DBDB102G  [DB]
C1  10uF  C-EUC1210K  [C1210K]
D1  SCHOTTKY-DIODESMD  [SMB]
F1  1.5A->750mA  R-EU_R1210  [R1210]
L1  BEAD  L-EUL2012C  [L2012C]
R1  10kR  R-EU_R0805W  [R0805W]
R2  2.2kR  R-EU_R0805W  [R0805W]
R3  10kR  R-EU_R0805W  [R0805W]
R4  2.2kR  R-EU_R0805W  [R0805W]
R5  VARISTORCN1206  [CT/CN1206]
R6  VARISTORCN1210  [CT/CN1210]

### Module instances
A1 = POW-IPMC/TOK

### Nets
COM.RRX: R1.1 R2.2
GND: C1.2 R2.1 R4.1 R5.1
MON.VPWR: R3.1 R4.2
N$1: D1.C L1.1 R1.2
V+PWR: B3.+ C1.1 F1.1 L1.2 R3.2 R5.2
VF+OUT: F1.2
V~!IN: B3.AC1
V~IN: B3.AC2 D1.A
Unconnected: B3.- R6.1 R6.2

### Notes on the sheet
- [TODO1]
- [TODO2]
- [equ1] | [equ1]
- [equ1]: Rail Voltage Divider
  V|in = [18 20]V
  V|out = [3.3 3.8]V
  
  V|out = A*V|in -> A = ~10/12
  R1 = 10k
  A = R2/(R1+R2) -> R2= ~ 2.2kR

### Library data of the parts
B3 = rectifier:DB?*G: Single Phase 1.0 AMP Glass Passivated Bridge Rectifier Taiwan Semiconductor Co.,Ltd. - TSC Source: http://www.taiwansemi.com/TSCbig5/ezcatfiles/cust/img/img/db101g.pdf http://www.ts.com.tw/db/pictures/modules/PDT/PDT060207001/DBLS201G.pdf
C1 = rcl:C-EU: CAPACITOR, European symbol
D1 = diode:SCHOTTKY-DIODE: Schottky Diode
F1 R1-R4 = rcl:R-EU_: RESISTOR, European symbol
L1 = rcl:L-EU: INDUCTOR, European symbol
R5 R6 = varistor:VARISTOR: VARISTOR